# Altium project CameraSBC.PrjPcb
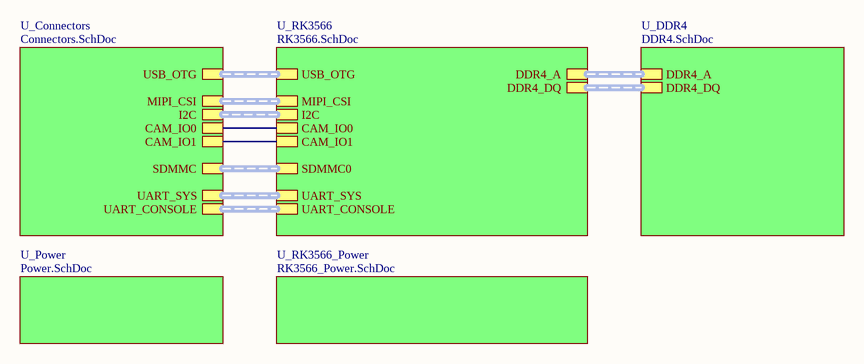
[diagram p0: Overview.SchDoc]
6 sheets, 95 parts. Net scope: hierarchical (ports join the sheet entries above them; power ports are global).
Board file: Layout.PcbDoc
Sheets:
  Overview.SchDoc
    U_RK3566_Power = RK3566_Power.SchDoc
    U_RK3566 = RK3566.SchDoc
    U_Connectors = Connectors.SchDoc
    U_DDR4 = DDR4.SchDoc
    U_Power = Power.SchDoc

## Sheet Overview.SchDoc
size A4; SheetNumber: 1; SheetTotal: 6

### Sub-sheets
U_Connectors = Connectors.SchDoc: USB_OTG (harness USB_OTG), MIPI_CSI (harness MIPI_CSI), I2C (harness I2C), CAM_IO0, CAM_IO1, SDMMC (harness SDMMC), UART_SYS (harness UART), UART_CONSOLE (harness UART)
U_DDR4 = DDR4.SchDoc: DDR4_A (harness DDR4_A), DDR4_DQ (harness DDR4_DQ)
U_Power = Power.SchDoc: no entries
U_RK3566 = RK3566.SchDoc: MIPI_CSI (harness MIPI_CSI), SDMMC0 (harness SDMMC0), I2C (harness I2C), USB_OTG (harness USB_OTG), DDR4_DQ (harness DDR4_DQ), DDR4_A (harness DDR4_ACC), UART_SYS (harness UART_SYS), UART_CONSOLE (harness UART_CONSOLE), CAM_IO0, CAM_IO1
U_RK3566_Power = RK3566_Power.SchDoc: no entries

### Nets
CAM_IO0: sheet U_RK3566/CAM_IO0, sheet U_Connectors/CAM_IO0
CAM_IO1: sheet U_RK3566/CAM_IO1, sheet U_Connectors/CAM_IO1

### Buses and harness runs
harness sheet U_Connectors/I2C = sheet U_RK3566/I2C
harness sheet U_Connectors/MIPI_CSI = sheet U_RK3566/MIPI_CSI
harness sheet U_Connectors/SDMMC = sheet U_RK3566/SDMMC0
harness sheet U_Connectors/UART_CONSOLE = sheet U_RK3566/UART_CONSOLE
harness sheet U_Connectors/UART_SYS = sheet U_RK3566/UART_SYS
harness sheet U_Connectors/USB_OTG = sheet U_RK3566/USB_OTG
harness sheet U_DDR4/DDR4_A = sheet U_RK3566/DDR4_A
harness sheet U_DDR4/DDR4_DQ = sheet U_RK3566/DDR4_DQ

## Sheet RK3566_Power.SchDoc
size A2; SheetNumber: 3; SheetTotal: 6
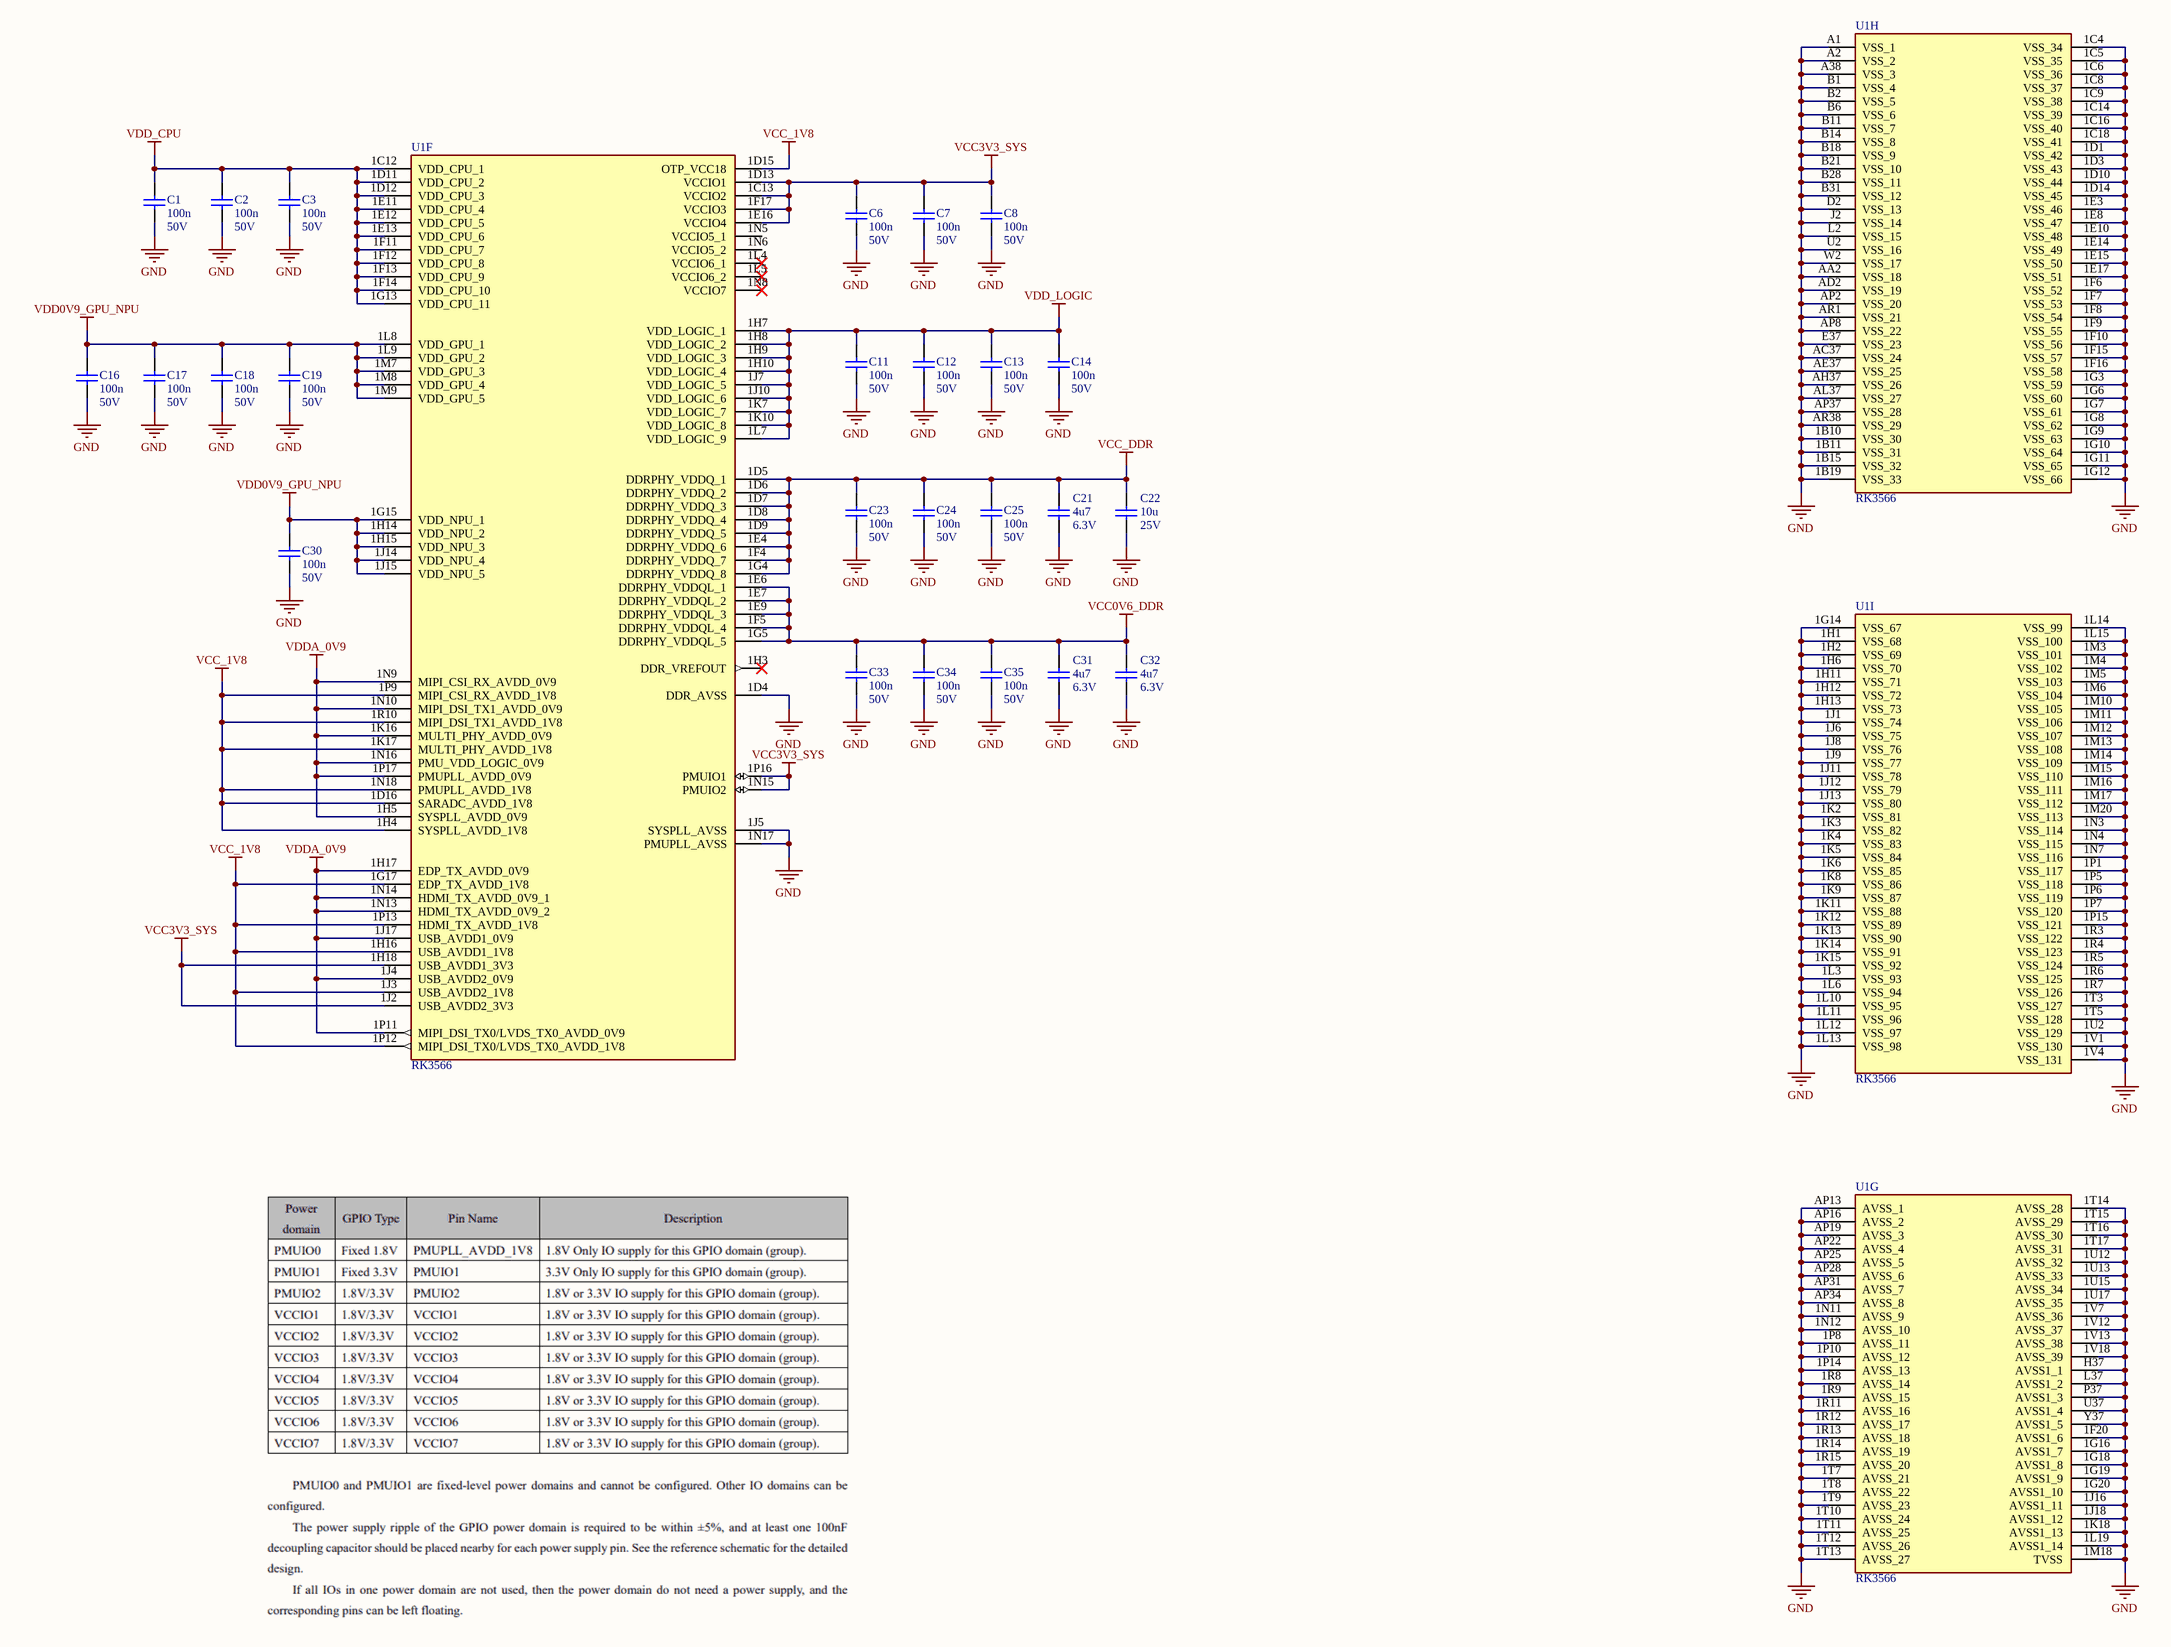
[diagram p1: RK3566_Power.SchDoc]

### Parts
C1  value 100n  Voltage: 50V  [GRM155R71H104KE14D]  (hidden comment: GRM155R71H104KE14D)
C2  value 100n  Voltage: 50V  [GRM155R71H104KE14D]  (hidden comment: GRM155R71H104KE14D)
C3  value 100n  Voltage: 50V  [GRM155R71H104KE14D]  (hidden comment: GRM155R71H104KE14D)
C6  value 100n  Voltage: 50V  [GRM155R71H104KE14D]  (hidden comment: GRM155R71H104KE14D)
C7  value 100n  Voltage: 50V  [GRM155R71H104KE14D]  (hidden comment: GRM155R71H104KE14D)
C8  value 100n  Voltage: 50V  [GRM155R71H104KE14D]  (hidden comment: GRM155R71H104KE14D)
C11  value 100n  Voltage: 50V  [GRM155R71H104KE14D]  (hidden comment: GRM155R71H104KE14D)
C12  value 100n  Voltage: 50V  [GRM155R71H104KE14D]  (hidden comment: GRM155R71H104KE14D)
C13  value 100n  Voltage: 50V  [GRM155R71H104KE14D]  (hidden comment: GRM155R71H104KE14D)
C14  value 100n  Voltage: 50V  [GRM155R71H104KE14D]  (hidden comment: GRM155R71H104KE14D)
C16  value 100n  Voltage: 50V  [GRM155R71H104KE14D]  (hidden comment: GRM155R71H104KE14D)
C17  value 100n  Voltage: 50V  [GRM155R71H104KE14D]  (hidden comment: GRM155R71H104KE14D)
C18  value 100n  Voltage: 50V  [GRM155R71H104KE14D]  (hidden comment: GRM155R71H104KE14D)
C19  value 100n  Voltage: 50V  [GRM155R71H104KE14D]  (hidden comment: GRM155R71H104KE14D)
C21  value 4u7  Voltage: 6.3V  [GRM155R60J475ME47D]  (hidden comment: GRM155R60J475ME47D)
C22  value 10u  Voltage: 25V  (hidden comment: GRM188R61E106MA73D)
C23  value 100n  Voltage: 50V  [GRM155R71H104KE14D]  (hidden comment: GRM155R71H104KE14D)
C24  value 100n  Voltage: 50V  [GRM155R71H104KE14D]  (hidden comment: GRM155R71H104KE14D)
C25  value 100n  Voltage: 50V  [GRM155R71H104KE14D]  (hidden comment: GRM155R71H104KE14D)
C30  value 100n  Voltage: 50V  [GRM155R71H104KE14D]  (hidden comment: GRM155R71H104KE14D)
C31  value 4u7  Voltage: 6.3V  [GRM155R60J475ME47D]  (hidden comment: GRM155R60J475ME47D)
C32  value 4u7  Voltage: 6.3V  [GRM155R60J475ME47D]  (hidden comment: GRM155R60J475ME47D)
C33  value 100n  Voltage: 50V  [GRM155R71H104KE14D]  (hidden comment: GRM155R71H104KE14D)
C34  value 100n  Voltage: 50V  [GRM155R71H104KE14D]  (hidden comment: GRM155R71H104KE14D)
C35  value 100n  Voltage: 50V  [GRM155R71H104KE14D]  (hidden comment: GRM155R71H104KE14D)
U1  RK3566  [RK3566]  (parts F,G,H,I of 9)

### Nets
GND: C1.2 C2.2 C3.2 C6.2 C7.2 C8.2 C11.2 C12.2 C13.2 C14.2 C16.2 C17.2 C18.2 C19.2 C21.2 C22.2 C23.2 C24.2 C25.2 C30.2 C31.2 C32.2 C33.2 C34.2 C35.2 U1.1B10(VSS_30) U1.1B11(VSS_31) U1.1B15(VSS_32) U1.1B19(VSS_33) U1.1C4(VSS_34) U1.1C5(VSS_35) U1.1C6(VSS_36) U1.1C8(VSS_37) U1.1C9(VSS_38) U1.1C14(VSS_39) U1.1C16(VSS_40) U1.1C18(VSS_41) U1.1D1(VSS_42) U1.1D3(VSS_43) U1.1D4(DDR_AVSS) U1.1D10(VSS_44) U1.1D14(VSS_45) U1.1E3(VSS_46) U1.1E8(VSS_47) U1.1E10(VSS_48) U1.1E14(VSS_49) U1.1E15(VSS_50) U1.1E17(VSS_51) U1.1F6(VSS_52) U1.1F7(VSS_53) U1.1F8(VSS_54) U1.1F9(VSS_55) U1.1F10(VSS_56) U1.1F15(VSS_57) U1.1F16(VSS_58) U1.1F20(AVSS1_6) U1.1G3(VSS_59) U1.1G6(VSS_60) U1.1G7(VSS_61) U1.1G8(VSS_62) U1.1G9(VSS_63) U1.1G10(VSS_64) U1.1G11(VSS_65) U1.1G12(VSS_66) U1.1G14(VSS_67) U1.1G16(AVSS1_7) U1.1G18(AVSS1_8) U1.1G19(AVSS1_9) U1.1G20(AVSS1_10) U1.1H1(VSS_68) U1.1H2(VSS_69) U1.1H6(VSS_70) U1.1H11(VSS_71) U1.1H12(VSS_72) U1.1H13(VSS_73) U1.1J1(VSS_74) U1.1J5(SYSPLL_AVSS) U1.1J6(VSS_75) U1.1J8(VSS_76) U1.1J9(VSS_77) U1.1J11(VSS_78) U1.1J12(VSS_79) U1.1J13(VSS_80) U1.1J16(AVSS1_11) U1.1J18(AVSS1_12) U1.1K2(VSS_81) U1.1K3(VSS_82) U1.1K4(VSS_83) U1.1K5(VSS_84) U1.1K6(VSS_85) U1.1K8(VSS_86) U1.1K9(VSS_87) U1.1K11(VSS_88) U1.1K12(VSS_89) U1.1K13(VSS_90) U1.1K14(VSS_91) U1.1K15(VSS_92) U1.1K18(AVSS1_13) U1.1L3(VSS_93) U1.1L6(VSS_94) U1.1L10(VSS_95) U1.1L11(VSS_96) U1.1L12(VSS_97) U1.1L13(VSS_98) U1.1L14(VSS_99) U1.1L15(VSS_100) U1.1L19(AVSS1_14) U1.1M3(VSS_101) U1.1M4(VSS_102) U1.1M5(VSS_103) U1.1M6(VSS_104) U1.1M10(VSS_105) U1.1M11(VSS_106) U1.1M12(VSS_107) U1.1M13(VSS_108) U1.1M14(VSS_109) U1.1M15(VSS_110) U1.1M16(VSS_111) U1.1M17(VSS_112) U1.1M18(TVSS) U1.1M20(VSS_113) U1.1N3(VSS_114) U1.1N4(VSS_115) U1.1N7(VSS_116) U1.1N11(AVSS_9) U1.1N12(AVSS_10) U1.1N17(PMUPLL_AVSS) U1.1P1(VSS_117) U1.1P5(VSS_118) U1.1P6(VSS_119) U1.1P7(VSS_120) U1.1P8(AVSS_11) U1.1P10(AVSS_12) U1.1P14(AVSS_13) U1.1P15(VSS_121) U1.1R3(VSS_122) U1.1R4(VSS_123) U1.1R5(VSS_124) U1.1R6(VSS_125) U1.1R7(VSS_126) U1.1R8(AVSS_14) U1.1R9(AVSS_15) U1.1R11(AVSS_16) U1.1R12(AVSS_17) U1.1R13(AVSS_18) U1.1R14(AVSS_19) U1.1R15(AVSS_20) U1.1T3(VSS_127) U1.1T5(VSS_128) U1.1T7(AVSS_21) U1.1T8(AVSS_22) U1.1T9(AVSS_23) U1.1T10(AVSS_24) U1.1T11(AVSS_25) U1.1T12(AVSS_26) U1.1T13(AVSS_27) U1.1T14(AVSS_28) U1.1T15(AVSS_29) U1.1T16(AVSS_30) U1.1T17(AVSS_31) U1.1U2(VSS_129) U1.1U12(AVSS_32) U1.1U13(AVSS_33) U1.1U15(AVSS_34) U1.1U17(AVSS_35) U1.1V1(VSS_130) U1.1V4(VSS_131) U1.1V7(AVSS_36) U1.1V12(AVSS_37) U1.1V13(AVSS_38) U1.1V18(AVSS_39) U1.A1(VSS_1) U1.A2(VSS_2) U1.A38(VSS_3) U1.AA2(VSS_18) U1.AC37(VSS_24) U1.AD2(VSS_19) U1.AE37(VSS_25) U1.AH37(VSS_26) U1.AL37(VSS_27) U1.AP2(VSS_20) U1.AP8(VSS_22) U1.AP13(AVSS_1) U1.AP16(AVSS_2) U1.AP19(AVSS_3) U1.AP22(AVSS_4) U1.AP25(AVSS_5) U1.AP28(AVSS_6) U1.AP31(AVSS_7) U1.AP34(AVSS_8) U1.AP37(VSS_28) U1.AR1(VSS_21) U1.AR38(VSS_29) U1.B1(VSS_4) U1.B2(VSS_5) U1.B6(VSS_6) U1.B11(VSS_7) U1.B14(VSS_8) U1.B18(VSS_9) U1.B21(VSS_10) U1.B28(VSS_11) U1.B31(VSS_12) U1.D2(VSS_13) U1.E37(VSS_23) U1.H37(AVSS1_1) U1.J2(VSS_14) U1.L2(VSS_15) U1.L37(AVSS1_2) U1.P37(AVSS1_3) U1.U2(VSS_16) U1.U37(AVSS1_4) U1.W2(VSS_17) U1.Y37(AVSS1_5)
VCC0V6_DDR: C31.1 C32.1 C33.1 C34.1 C35.1 U1.1E6(DDRPHY_VDDQL_1) U1.1E7(DDRPHY_VDDQL_2) U1.1E9(DDRPHY_VDDQL_3) U1.1F5(DDRPHY_VDDQL_4) U1.1G5(DDRPHY_VDDQL_5)
VCC3V3_SYS: C6.1 C7.1 C8.1 U1.1C13(VCCIO2) U1.1D13(VCCIO1) U1.1E16(VCCIO4) U1.1F17(VCCIO3) U1.1H18(USB_AVDD1_3V3) U1.1J2(USB_AVDD2_3V3) U1.1N15(PMUIO2) U1.1P16(PMUIO1)
VCC_1V8: U1.1D15(OTP_VCC18) U1.1D16(SARADC_AVDD_1V8) U1.1G17(EDP_TX_AVDD_1V8) U1.1H4(SYSPLL_AVDD_1V8) U1.1H16(USB_AVDD1_1V8) U1.1J3(USB_AVDD2_1V8) U1.1K17(MULTI_PHY_AVDD_1V8) U1.1N18(PMUPLL_AVDD_1V8) U1.1P9(MIPI_CSI_RX_AVDD_1V8) U1.1P12(MIPI_DSI_TX0/LVDS_TX0_AVDD_1V8) U1.1P13(HDMI_TX_AVDD_1V8) U1.1R10(MIPI_DSI_TX1_AVDD_1V8)
VCC_DDR: C21.1 C22.1 C23.1 C24.1 C25.1 U1.1D5(DDRPHY_VDDQ_1) U1.1D6(DDRPHY_VDDQ_2) U1.1D7(DDRPHY_VDDQ_3) U1.1D8(DDRPHY_VDDQ_4) U1.1D9(DDRPHY_VDDQ_5) U1.1E4(DDRPHY_VDDQ_6) U1.1F4(DDRPHY_VDDQ_7) U1.1G4(DDRPHY_VDDQ_8)
VDD0V9_GPU_NPU: C16.1 C17.1 C18.1 C19.1 C30.1 U1.1G15(VDD_NPU_1) U1.1H14(VDD_NPU_2) U1.1H15(VDD_NPU_3) U1.1J14(VDD_NPU_4) U1.1J15(VDD_NPU_5) U1.1L8(VDD_GPU_1) U1.1L9(VDD_GPU_2) U1.1M7(VDD_GPU_3) U1.1M8(VDD_GPU_4) U1.1M9(VDD_GPU_5)
VDD_CPU: C1.1 C2.1 C3.1 U1.1C12(VDD_CPU_1) U1.1D11(VDD_CPU_2) U1.1D12(VDD_CPU_3) U1.1E11(VDD_CPU_4) U1.1E12(VDD_CPU_5) U1.1E13(VDD_CPU_6) U1.1F11(VDD_CPU_7) U1.1F12(VDD_CPU_8) U1.1F13(VDD_CPU_9) U1.1F14(VDD_CPU_10) U1.1G13(VDD_CPU_11)
VDD_LOGIC: C11.1 C12.1 C13.1 C14.1 U1.1H7(VDD_LOGIC_1) U1.1H8(VDD_LOGIC_2) U1.1H9(VDD_LOGIC_3) U1.1H10(VDD_LOGIC_4) U1.1J7(VDD_LOGIC_5) U1.1J10(VDD_LOGIC_6) U1.1K7(VDD_LOGIC_7) U1.1K10(VDD_LOGIC_8) U1.1L7(VDD_LOGIC_9)
VDDA_0V9: U1.1H5(SYSPLL_AVDD_0V9) U1.1H17(EDP_TX_AVDD_0V9) U1.1J4(USB_AVDD2_0V9) U1.1J17(USB_AVDD1_0V9) U1.1K16(MULTI_PHY_AVDD_0V9) U1.1N9(MIPI_CSI_RX_AVDD_0V9) U1.1N10(MIPI_DSI_TX1_AVDD_0V9) U1.1N13(HDMI_TX_AVDD_0V9_2) U1.1N14(HDMI_TX_AVDD_0V9_1) U1.1N16(PMU_VDD_LOGIC_0V9) U1.1P11(MIPI_DSI_TX0/LVDS_TX0_AVDD_0V9) U1.1P17(PMUPLL_AVDD_0V9)

Not connected (* = marked no-connect by the designer): U1 1H3(DDR_VREFOUT)* 1L4(VCCIO6_1)* 1L5(VCCIO6_2)* 1N5(VCCIO5_1) 1N6(VCCIO5_2) 1N8(VCCIO7)*

### Library data of the parts
C1-C3 C6-C8 C11-C14 C16-C19 C23-C25 C30 C33-C35 = GRM155R71H104KE14D: CAP 100N 50V X7R 0402; Size: 0402; Dielectric: X7R; Manufacturer Part Number 1: GRM155R71H104KE14D
C21 C31 C32 = GRM155R60J475ME47D: CAP 4.7U 6.3V X5R 0402; Size: 0402; Dielectric: X5R; Manufacturer Part Number 1: GRM155R60J475ME47D
C22 = GRM188R61E106MA73D: CAP 10U 25V X5R 0603; Size: 0603; Dielectric: X5R
U1 = RK3566: high-performance and low-power quad-core application processor; MF: Fuzhou Rockchip Electronics Co; SnapEDA_Link: https://www.snapeda.com/parts/RK3566/Fuzhou+Rockchip+Electronics+Co/view-part/?ref=snap; Package: None; Value: *; MP: RK3566; Check_prices: https://www.snapeda.com/parts/RK3566/Fuzhou+Rockchip+Electronics+Co/view-part/?ref=eda

## Sheet RK3566.SchDoc
size A1; SheetNumber: 2; SheetTotal: 6
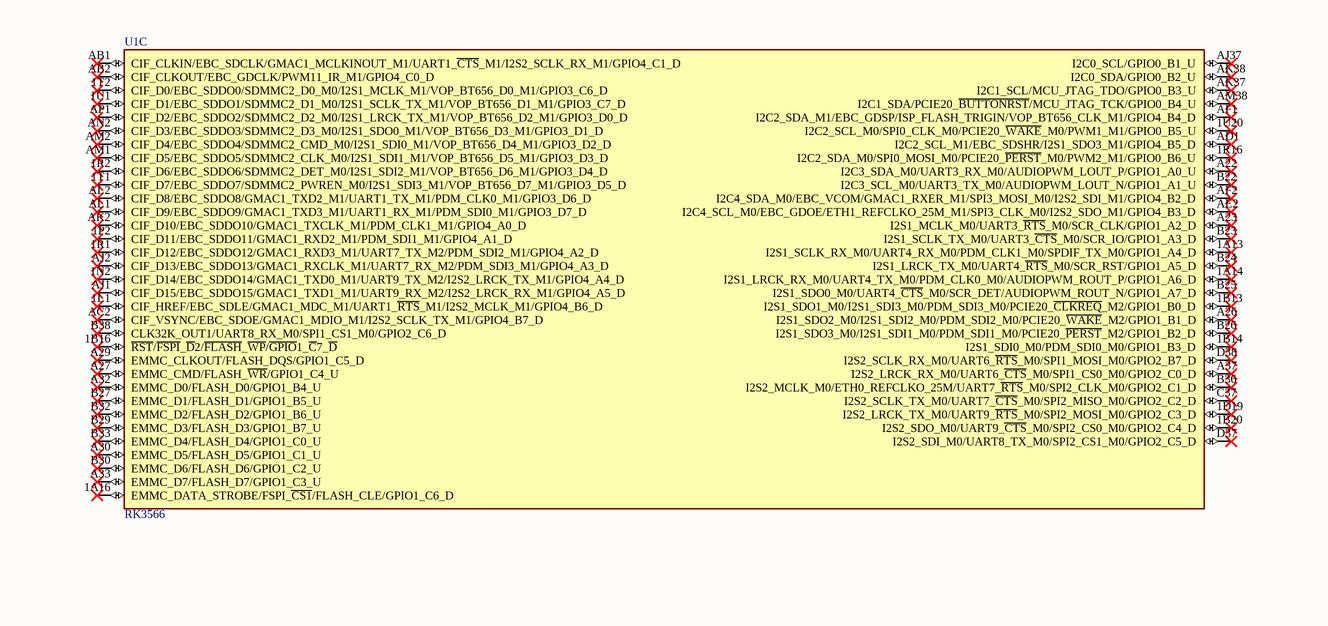
[diagram p2: RK3566.SchDoc, top left]
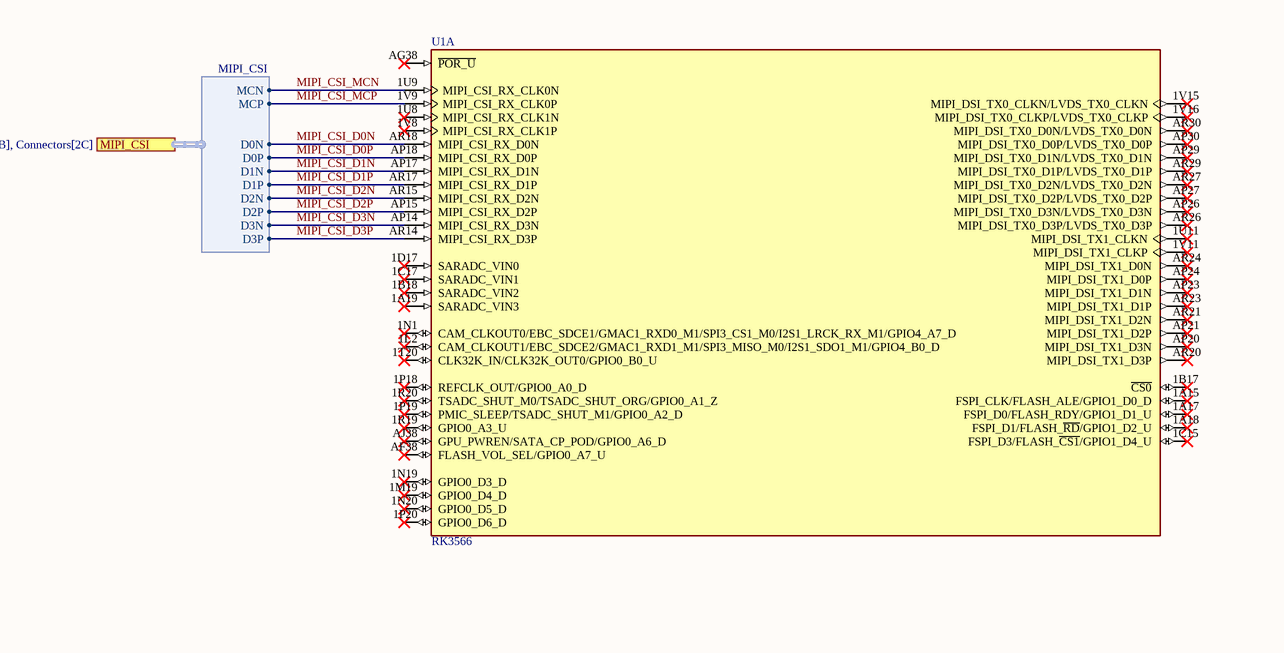
[diagram p3: RK3566.SchDoc, top right]
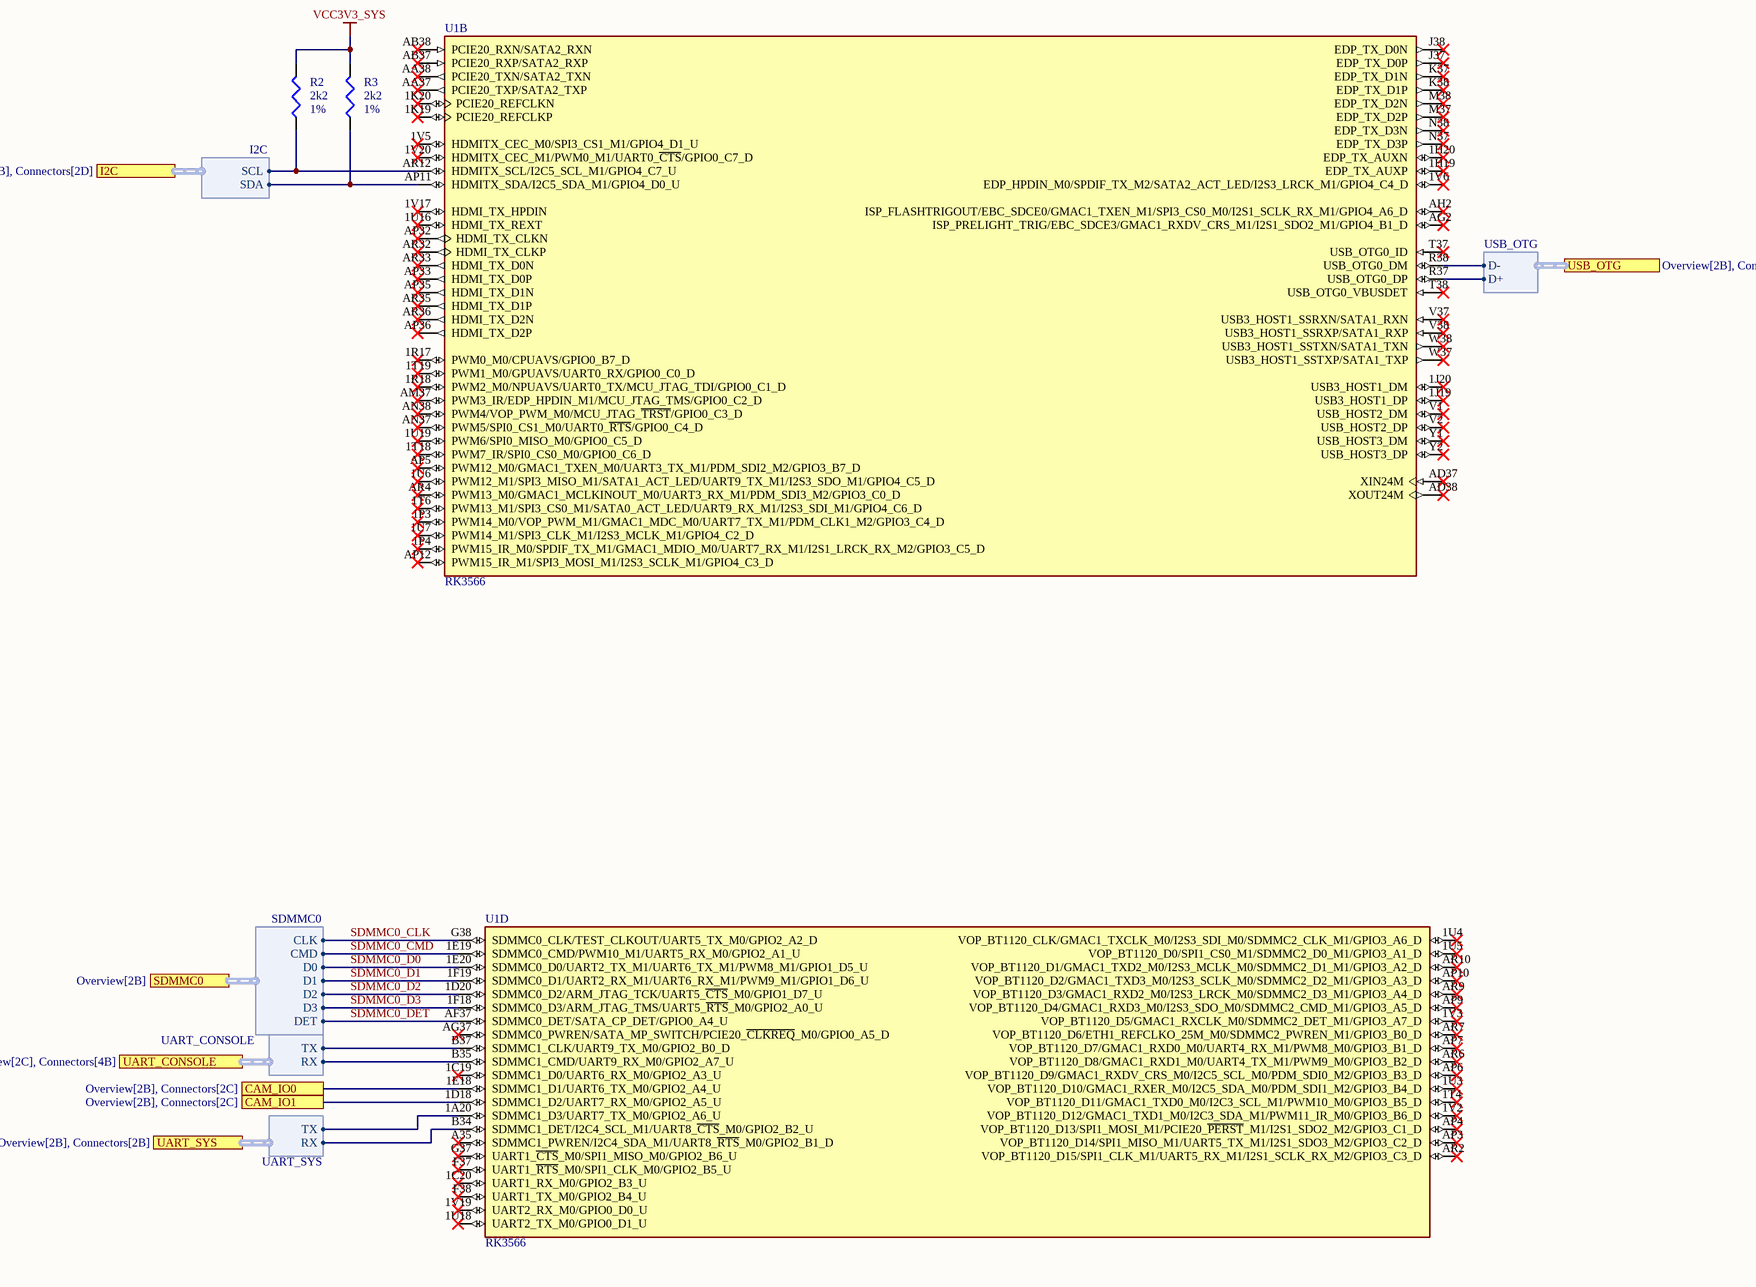
[diagram p4: RK3566.SchDoc, bottom left]
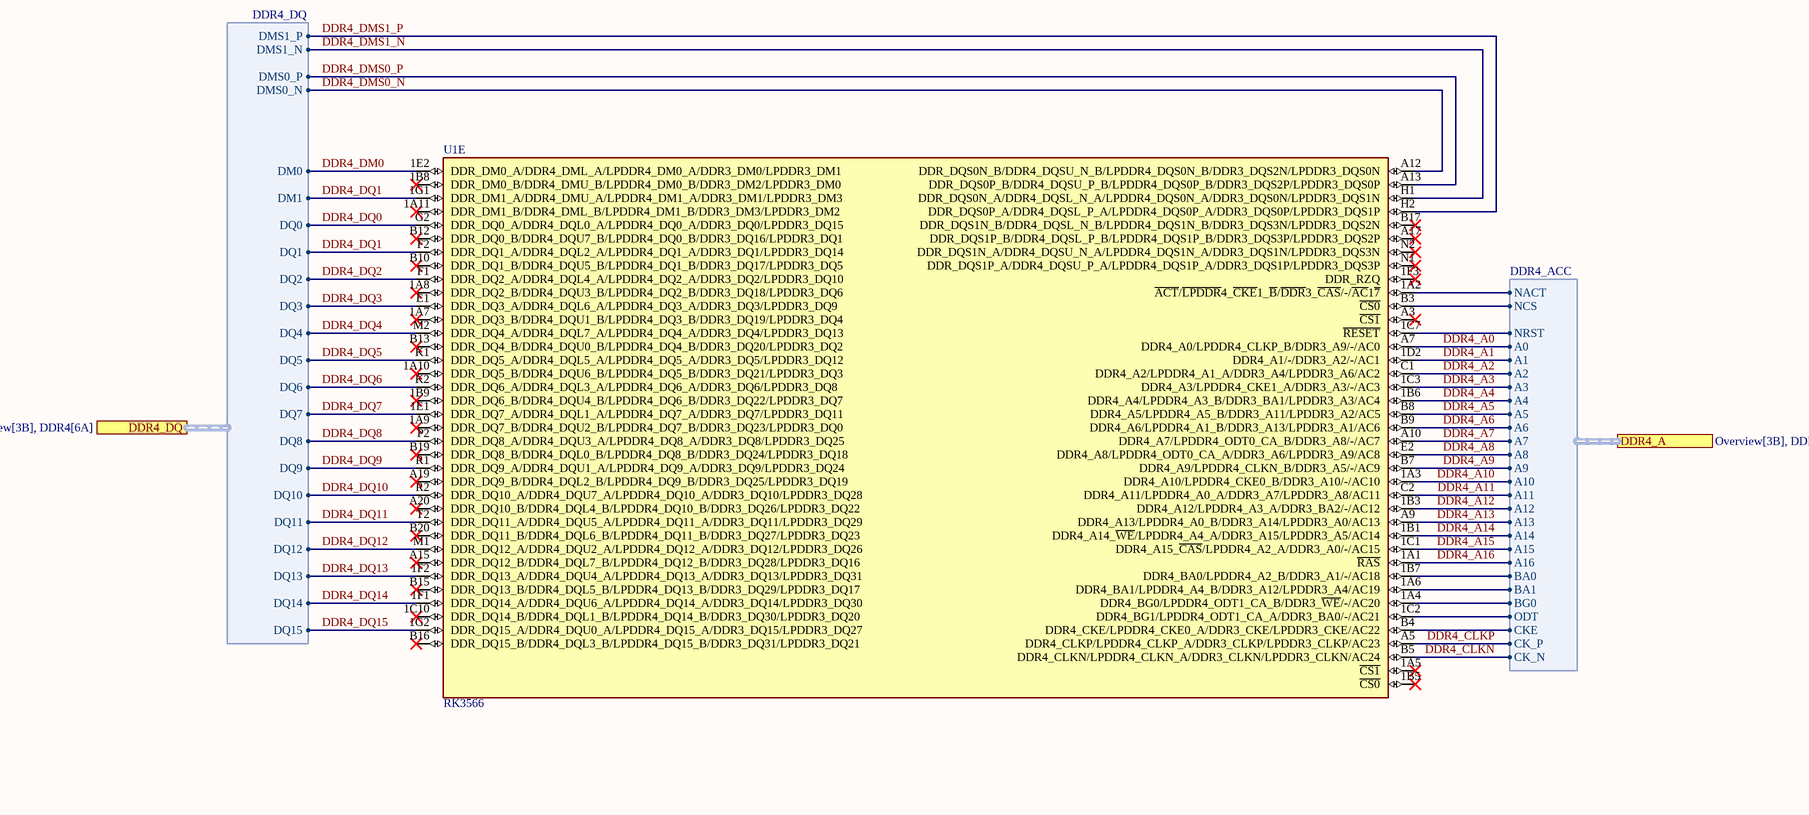
[diagram p5: RK3566.SchDoc, bottom right]

### Parts
R2  value 2k2  Tolerance: 1%  [RC0402FR-075K6L]  (hidden comment: RES 2.2K)
R3  value 2k2  Tolerance: 1%  [RC0402FR-075K6L]  (hidden comment: RES 2.2K)
U1  RK3566  [RK3566]  (parts A,B,C,D,E of 9)

### Ports
CAM_IO0 (see Overview[2B], Connectors[2C]), CAM_IO1 (see Overview[2B], Connectors[2C]), DDR4_A (harness DDR4_ACC, see Overview[3B], DDR4[2B]), DDR4_DQ (harness DDR4_DQ, see Overview[3B], DDR4[6A]), I2C (harness I2C, see Overview[2B], Connectors[2D]), MIPI_CSI (harness MIPI_CSI, see Overview[2B], Connectors[2C]), SDMMC0 (harness SDMMC0, see Overview[2B]), UART_CONSOLE (harness UART_CONSOLE, see Overview[2C], Connectors[4B]), UART_SYS (harness UART_SYS, see Overview[2B], Connectors[2B]), USB_OTG (harness USB_OTG, see Overview[2B], Connectors[6B])

### Harnesses
MIPI_CSI: D0N, D0P, MCN, MCP, D1P, D1N, D2P, D2N, D3N, D3P
SDMMC0: CLK, CMD, D0, D1, D3, D2, DET
I2C: SCL, SDA
USB_OTG: D-, D+
DDR4_ACC: A0, A1, A2, A3, A4, A5, A6, A7, A8, A10, A9, A11, A13, A12, A14, A15, A16, NCS, NACT, BG0, BA0, BA1, CKE, CK_P, CK_N, ODT, NRST
DDR4_DQ: DQ0, DQ1, DQ2, DQ3, DQ4, DQ5, DQ6, DQ7, DQ8, DQ10, DQ9, DQ11, DQ13, DQ12, DQ14, DQ15, DMS0_P, DMS0_N, DMS1_N, DMS1_P, DM0, DM1
UART_SYS: TX, RX
UART_CONSOLE: TX, RX

### Nets
VCC3V3_SYS: R2.1 R3.1
CAM_IO0: U1.1E18(SDMMC1_D1/UART6_TX_M0/GPIO2_A4_U) ; port CAM_IO0
CAM_IO1: U1.1D18(SDMMC1_D2/UART7_RX_M0/GPIO2_A5_U) ; port CAM_IO1
CAM_SCL: R2.2 U1.AR12(HDMITX_SCL/I2C5_SCL_M1/GPIO4_C7_U) ; port I2C.SCL
CAM_SDA: R3.2 U1.AP11(HDMITX_SDA/I2C5_SDA_M1/GPIO4_D0_U) ; port I2C.SDA
DDR4_A0: U1.A7(DDR4_A0/LPDDR4_CLKP_B/DDR3_A9/-/AC0) ; port DDR4_A.A0
DDR4_A1: U1.1D2(DDR4_A1/-/DDR3_A2/-/AC1) ; port DDR4_A.A1
DDR4_A2: U1.C1(DDR4_A2/LPDDR4_A1_A/DDR3_A4/LPDDR3_A6/AC2) ; port DDR4_A.A2
DDR4_A3: U1.1C3(DDR4_A3/LPDDR4_CKE1_A/DDR3_A3/-/AC3) ; port DDR4_A.A3
DDR4_A4: U1.1B6(DDR4_A4/LPDDR4_A3_B/DDR3_BA1/LPDDR3_A3/AC4) ; port DDR4_A.A4
DDR4_A5: U1.B8(DDR4_A5/LPDDR4_A5_B/DDR3_A11/LPDDR3_A2/AC5) ; port DDR4_A.A5
DDR4_A6: U1.B9(DDR4_A6/LPDDR4_A1_B/DDR3_A13/LPDDR3_A1/AC6) ; port DDR4_A.A6
DDR4_A7: U1.A10(DDR4_A7/LPDDR4_ODT0_CA_B/DDR3_A8/-/AC7) ; port DDR4_A.A7
DDR4_A8: U1.E2(DDR4_A8/LPDDR4_ODT0_CA_A/DDR3_A6/LPDDR3_A9/AC8) ; port DDR4_A.A8
DDR4_A9: U1.B7(DDR4_A9/LPDDR4_CLKN_B/DDR3_A5/-/AC9) ; port DDR4_A.A9
DDR4_A10: U1.1A3(DDR4_A10/LPDDR4_CKE0_B/DDR3_A10/-/AC10) ; port DDR4_A.A10
DDR4_A11: U1.C2(DDR4_A11/LPDDR4_A0_A/DDR3_A7/LPDDR3_A8/AC11) ; port DDR4_A.A11
DDR4_A12: U1.1B3(DDR4_A12/LPDDR4_A3_A/DDR3_BA2/-/AC12) ; port DDR4_A.A12
DDR4_A13: U1.A9(DDR4_A13/LPDDR4_A0_B/DDR3_A14/LPDDR3_A0/AC13) ; port DDR4_A.A13
DDR4_A14: U1.1B1(DDR4_A14_~{WE}/LPDDR4_A4_A/DDR3_A15/LPDDR3_A5/AC14) ; port DDR4_A.A14
DDR4_A15: U1.1C1(DDR4_A15_~{CAS}/LPDDR4_A2_A/DDR3_A0/-/AC15) ; port DDR4_A.A15
DDR4_A16: U1.1A1(~{RAS}) ; port DDR4_A.A16
DDR4_BA0: U1.1B7(DDR4_BA0/LPDDR4_A2_B/DDR3_A1/-/AC18) ; port DDR4_A.BA0
DDR4_BA1: U1.1A6(DDR4_BA1/LPDDR4_A4_B/DDR3_A12/LPDDR3_A4/AC19) ; port DDR4_A.BA1
DDR4_BG0: U1.1A4(DDR4_BG0/LPDDR4_ODT1_CA_B/DDR3_~{WE}/-/AC20) ; port DDR4_A.BG0
DDR4_CKE: U1.B4(DDR4_CKE/LPDDR4_CKE0_A/DDR3_CKE/LPDDR3_CKE/AC22) ; port DDR4_A.CKE
DDR4_CLKN: U1.B5(DDR4_CLKN/LPDDR4_CLKN_A/DDR3_CLKN/LPDDR3_CLKN/AC24) ; port DDR4_A.CK_N  [project net DDR4_CK_N]
DDR4_CLKP: U1.A5(DDR4_CLKP/LPDDR4_CLKP_A/DDR3_CLKP/LPDDR3_CLKP/AC23) ; port DDR4_A.CK_P  [project net DDR4_CK_P]
DDR4_DM0: U1.1E2(DDR_DM0_A/DDR4_DML_A/LPDDR4_DM0_A/DDR3_DM0/LPDDR3_DM1) ; port DDR4_DQ.DM0
DDR4_DMS0_N: U1.A12(DDR_DQS0N_B/DDR4_DQSU_N_B/LPDDR4_DQS0N_B/DDR3_DQS2N/LPDDR3_DQS0N) ; port DDR4_DQ.DMS0_N
DDR4_DMS0_P: U1.A13(DDR_DQS0P_B/DDR4_DQSU_P_B/LPDDR4_DQS0P_B/DDR3_DQS2P/LPDDR3_DQS0P) ; port DDR4_DQ.DMS0_P
DDR4_DMS1_N: U1.H1(DDR_DQS0N_A/DDR4_DQSL_N_A/LPDDR4_DQS0N_A/DDR3_DQS0N/LPDDR3_DQS1N) ; port DDR4_DQ.DMS1_N
DDR4_DMS1_P: U1.H2(DDR_DQS0P_A/DDR4_DQSL_P_A/LPDDR4_DQS0P_A/DDR3_DQS0P/LPDDR3_DQS1P) ; port DDR4_DQ.DMS1_P
DDR4_DQ0: U1.G2(DDR_DQ0_A/DDR4_DQL0_A/LPDDR4_DQ0_A/DDR3_DQ0/LPDDR3_DQ15) ; port DDR4_DQ.DQ0
DDR4_DQ1: U1.1G1(DDR_DM1_A/DDR4_DMU_A/LPDDR4_DM1_A/DDR3_DM1/LPDDR3_DM3) U1.F2(DDR_DQ1_A/DDR4_DQL2_A/LPDDR4_DQ1_A/DDR3_DQ1/LPDDR3_DQ14) ; port DDR4_DQ.DQ1, port DDR4_DQ.DM1  [project net DDR4_DM1]
DDR4_DQ2: U1.F1(DDR_DQ2_A/DDR4_DQL4_A/LPDDR4_DQ2_A/DDR3_DQ2/LPDDR3_DQ10) ; port DDR4_DQ.DQ2
DDR4_DQ3: U1.E1(DDR_DQ3_A/DDR4_DQL6_A/LPDDR4_DQ3_A/DDR3_DQ3/LPDDR3_DQ9) ; port DDR4_DQ.DQ3
DDR4_DQ4: U1.M2(DDR_DQ4_A/DDR4_DQL7_A/LPDDR4_DQ4_A/DDR3_DQ4/LPDDR3_DQ13) ; port DDR4_DQ.DQ4
DDR4_DQ5: U1.K1(DDR_DQ5_A/DDR4_DQL5_A/LPDDR4_DQ5_A/DDR3_DQ5/LPDDR3_DQ12) ; port DDR4_DQ.DQ5
DDR4_DQ6: U1.K2(DDR_DQ6_A/DDR4_DQL3_A/LPDDR4_DQ6_A/DDR3_DQ6/LPDDR3_DQ8) ; port DDR4_DQ.DQ6
DDR4_DQ7: U1.1E1(DDR_DQ7_A/DDR4_DQL1_A/LPDDR4_DQ7_A/DDR3_DQ7/LPDDR3_DQ11) ; port DDR4_DQ.DQ7
DDR4_DQ8: U1.P2(DDR_DQ8_A/DDR4_DQU3_A/LPDDR4_DQ8_A/DDR3_DQ8/LPDDR3_DQ25) ; port DDR4_DQ.DQ8
DDR4_DQ9: U1.R1(DDR_DQ9_A/DDR4_DQU1_A/LPDDR4_DQ9_A/DDR3_DQ9/LPDDR3_DQ24) ; port DDR4_DQ.DQ9
DDR4_DQ10: U1.R2(DDR_DQ10_A/DDR4_DQU7_A/LPDDR4_DQ10_A/DDR3_DQ10/LPDDR3_DQ28) ; port DDR4_DQ.DQ10
DDR4_DQ11: U1.T2(DDR_DQ11_A/DDR4_DQU5_A/LPDDR4_DQ11_A/DDR3_DQ11/LPDDR3_DQ29) ; port DDR4_DQ.DQ11
DDR4_DQ12: U1.M1(DDR_DQ12_A/DDR4_DQU2_A/LPDDR4_DQ12_A/DDR3_DQ12/LPDDR3_DQ26) ; port DDR4_DQ.DQ12
DDR4_DQ13: U1.1F2(DDR_DQ13_A/DDR4_DQU4_A/LPDDR4_DQ13_A/DDR3_DQ13/LPDDR3_DQ31) ; port DDR4_DQ.DQ13
DDR4_DQ14: U1.1F1(DDR_DQ14_A/DDR4_DQU6_A/LPDDR4_DQ14_A/DDR3_DQ14/LPDDR3_DQ30) ; port DDR4_DQ.DQ14
DDR4_DQ15: U1.1G2(DDR_DQ15_A/DDR4_DQU0_A/LPDDR4_DQ15_A/DDR3_DQ15/LPDDR3_DQ27) ; port DDR4_DQ.DQ15
DDR4_NACT: U1.1A2(~{ACT}/~{LPDDR}4_~{CKE}1_~{B}/~{DDR}3_~{CAS}/-/~{AC}1~{7}) ; port DDR4_A.NACT
DDR4_NCS: U1.B3(~{CS0}) ; port DDR4_A.NCS
DDR4_NRST: U1.1C7(~{RESET}) ; port DDR4_A.NRST
DDR4_ODT: U1.1C2(DDR4_BG1/LPDDR4_ODT1_CA_A/DDR3_BA0/-/AC21) ; port DDR4_A.ODT
MIPI_CSI_D0N: U1.AR18(MIPI_CSI_RX_D0N) ; port MIPI_CSI.D0N
MIPI_CSI_D0P: U1.AP18(MIPI_CSI_RX_D0P) ; port MIPI_CSI.D0P
MIPI_CSI_D1N: U1.AP17(MIPI_CSI_RX_D1N) ; port MIPI_CSI.D1N
MIPI_CSI_D1P: U1.AR17(MIPI_CSI_RX_D1P) ; port MIPI_CSI.D1P
MIPI_CSI_D2N: U1.AR15(MIPI_CSI_RX_D2N) ; port MIPI_CSI.D2N
MIPI_CSI_D2P: U1.AP15(MIPI_CSI_RX_D2P) ; port MIPI_CSI.D2P
MIPI_CSI_D3N: U1.AP14(MIPI_CSI_RX_D3N) ; port MIPI_CSI.D3N
MIPI_CSI_D3P: U1.AR14(MIPI_CSI_RX_D3P) ; port MIPI_CSI.D3P
MIPI_CSI_MCN: U1.1U9(MIPI_CSI_RX_CLK0N) ; port MIPI_CSI.MCN
MIPI_CSI_MCP: U1.1V9(MIPI_CSI_RX_CLK0P) ; port MIPI_CSI.MCP
SDMMC0_CLK: U1.G38(SDMMC0_CLK/TEST_CLKOUT/UART5_TX_M0/GPIO2_A2_D) ; port SDMMC0.CLK
SDMMC0_CMD: U1.1E19(SDMMC0_CMD/PWM10_M1/UART5_RX_M0/GPIO2_A1_U) ; port SDMMC0.CMD
SDMMC0_D0: U1.1E20(SDMMC0_D0/UART2_TX_M1/UART6_TX_M1/PWM8_M1/GPIO1_D5_U) ; port SDMMC0.D0
SDMMC0_D1: U1.1F19(SDMMC0_D1/UART2_RX_M1/UART6_RX_M1/PWM9_M1/GPIO1_D6_U) ; port SDMMC0.D1
SDMMC0_D2: U1.1D20(SDMMC0_D2/ARM_JTAG_TCK/UART5_~{CTS}_M0/GPIO1_D7_U) ; port SDMMC0.D2
SDMMC0_D3: U1.1F18(SDMMC0_D3/ARM_JTAG_TMS/UART5_~{RTS}_M0/GPIO2_A0_U) ; port SDMMC0.D3
SDMMC0_DET: U1.AF37(SDMMC0_DET/SATA_CP_DET/GPIO0_A4_U) ; port SDMMC0.DET
UART_CONSOLE_RX: U1.B35(SDMMC1_CMD/UART9_RX_M0/GPIO2_A7_U) ; port UART_CONSOLE.RX
UART_CONSOLE_TX: U1.B37(SDMMC1_CLK/UART9_TX_M0/GPIO2_B0_D) ; port UART_CONSOLE.TX
UART_SYS_RX: U1.B34(SDMMC1_DET/I2C4_SCL_M1/UART8_~{CTS}_M0/GPIO2_B2_U) ; port UART_SYS.RX
UART_SYS_TX: U1.1A20(SDMMC1_D3/UART7_TX_M0/GPIO2_A6_U) ; port UART_SYS.TX
USB_OTG_D+: U1.R37(USB_OTG0_DP) ; port USB_OTG.D+
USB_OTG_D-: U1.R38(USB_OTG0_DM) ; port USB_OTG.D-

Not connected (* = marked no-connect by the designer): U1 1A5(~{CS1})* 1A7(DDR_DQ3_B/DDR4_DQU1_B/LPDDR4_DQ3_B/DDR3_DQ19/LPDDR3_DQ4)* 1A8(DDR_DQ2_B/DDR4_DQU3_B/LPDDR4_DQ2_B/DDR3_DQ18/LPDDR3_DQ6)* 1A9(DDR_DQ7_B/DDR4_DQU2_B/LPDDR4_DQ7_B/DDR3_DQ23/LPDDR3_DQ0)* 1A10(DDR_DQ5_B/DDR4_DQU6_B/LPDDR4_DQ5_B/DDR3_DQ21/LPDDR3_DQ3)* 1A11(DDR_DM1_B/DDR4_DML_B/LPDDR4_DM1_B/DDR3_DM3/LPDDR3_DM2)* 1A13(I2S1_SCLK_RX_M0/UART4_RX_M0/PDM_CLK1_M0/SPDIF_TX_M0/GPIO1_A4_D)* 1A14(I2S1_LRCK_RX_M0/UART4_TX_M0/PDM_CLK0_M0/AUDIOPWM_ROUT_P/GPIO1_A6_D)* 1A15(FSPI_CLK/FLASH_ALE/GPIO1_D0_D)* 1A16(EMMC_DATA_STROBE/FSPI_~{CS1}/FLASH_CLE/GPIO1_C6_D)* 1A17(FSPI_D0/FLASH_RDY/GPIO1_D1_U)* 1A18(FSPI_D1/FLASH_~{RD}/GPIO1_D2_U)* 1A19(SARADC_VIN3)* 1B5(~{CS0})* 1B8(DDR_DM0_B/DDR4_DMU_B/LPDDR4_DM0_B/DDR3_DM2/LPDDR3_DM0)* 1B9(DDR_DQ6_B/DDR4_DQU4_B/LPDDR4_DQ6_B/DDR3_DQ22/LPDDR3_DQ7)* 1B13(I2S1_SDO1_M0/I2S1_SDI3_M0/PDM_SDI3_M0/PCIE20_~{CLKREQ}_M2/GPIO1_B0_D)* 1B14(I2S1_SDI0_M0/PDM_SDI0_M0/GPIO1_B3_D)* 1B16(~{RST}/~{FSPI}_~{D}2/~{FLASH}_~{WP}/~{GPIO}1_~{C}7_~{D})* 1B17(~{CS0})* 1B18(SARADC_VIN2)* 1B20(I2S2_SDO_M0/UART9_~{CTS}_M0/SPI2_CS0_M0/GPIO2_C4_D)* 1C10(DDR_DQ14_B/DDR4_DQL1_B/LPDDR4_DQ14_B/DDR3_DQ30/LPDDR3_DQ20)* 1C15(FSPI_D3/FLASH_~{CS1}/GPIO1_D4_U)* 1C17(SARADC_VIN1)* 1C19(SDMMC1_D0/UART6_RX_M0/GPIO2_A3_U)* 1C20(UART1_RX_M0/GPIO2_B3_U)* 1D17(SARADC_VIN0)* 1D19(I2S2_LRCK_TX_M0/UART9_~{RTS}_M0/SPI2_MOSI_M0/GPIO2_C3_D)* 1F3(DDR_RZQ)* 1H19(EDP_TX_AUXP)* 1H20(EDP_TX_AUXN)* 1J19(USB3_HOST1_DP)* 1J20(USB3_HOST1_DM)* 1K19(PCIE20_REFCLKP)* 1K20(PCIE20_REFCLKN)* 1L1(CIF_HREF/EBC_SDLE/GMAC1_MDC_M1/UART1_~{RTS}_M1/I2S2_MCLK_M1/GPIO4_B6_D)* 1L2(CAM_CLKOUT1/EBC_SDCE2/GMAC1_RXD1_M1/SPI3_MISO_M0/I2S1_SDO1_M1/GPIO4_B0_D)* 1M19(GPIO0_D4_D)* 1N1(CAM_CLKOUT0/EBC_SDCE1/GMAC1_RXD0_M1/SPI3_CS1_M0/I2S1_LRCK_RX_M1/GPIO4_A7_D)* 1N2(CIF_D14/EBC_SDDO14/GMAC1_TXD0_M1/UART9_TX_M2/I2S2_LRCK_TX_M1/GPIO4_A4_D)* 1N19(GPIO0_D3_D)* 1N20(GPIO0_D5_D)* 1P2(CIF_D11/EBC_SDDO11/GMAC1_RXD2_M1/PDM_SDI1_M1/GPIO4_A1_D)* 1P3(PWM14_M0/VOP_PWM_M1/GMAC1_MDC_M0/UART7_TX_M1/PDM_CLK1_M2/GPIO3_C4_D)* 1P4(PWM15_IR_M0/SPDIF_TX_M1/GMAC1_MDIO_M0/UART7_RX_M1/I2S1_LRCK_RX_M2/GPIO3_C5_D)* 1P18(REFCLK_OUT/GPIO0_A0_D)* 1P19(PMIC_SLEEP/TSADC_SHUT_M1/GPIO0_A2_D)* 1P20(GPIO0_D6_D)* 1R1(CIF_D12/EBC_SDDO12/GMAC1_RXD3_M1/UART7_TX_M2/PDM_SDI2_M1/GPIO4_A2_D)* 1R2(CIF_D6/EBC_SDDO6/SDMMC2_DET_M0/I2S1_SDI2_M1/VOP_BT656_D6_M1/GPIO3_D4_D)* 1R16(I2C2_SDA_M0/SPI0_MOSI_M0/PCIE20_~{PERST}_M0/PWM2_M1/GPIO0_B6_U)* 1R17(PWM0_M0/CPUAVS/GPIO0_B7_D)* 1R18(PWM2_M0/NPUAVS/UART0_TX/MCU_JTAG_TDI/GPIO0_C1_D)* 1R19(GPIO0_A3_U)* 1R20(TSADC_SHUT_M0/TSADC_SHUT_ORG/GPIO0_A1_Z)* 1T1(CIF_D7/EBC_SDDO7/SDMMC2_PWREN_M0/I2S1_SDI3_M1/VOP_BT656_D7_M1/GPIO3_D5_D)* 1T2(CIF_D0/EBC_SDDO0/SDMMC2_D0_M0/I2S1_MCLK_M1/VOP_BT656_D0_M1/GPIO3_C6_D)* 1T4(VOP_BT1120_D11/GMAC1_TXD0_M0/I2C3_SCL_M1/PWM10_M0/GPIO3_B5_D)* 1T6(PWM13_M1/SPI3_CS0_M1/SATA0_ACT_LED/UART9_RX_M1/I2S3_SDI_M1/GPIO4_C6_D)* 1T18(PWM7_IR/SPI0_CS0_M0/GPIO0_C6_D)* 1T19(PWM1_M0/GPUAVS/UART0_RX/GPIO0_C0_D)* 1T20(CLK32K_IN/CLK32K_OUT0/GPIO0_B0_U)* 1U1(CIF_D1/EBC_SDDO1/SDMMC2_D1_M0/I2S1_SCLK_TX_M1/VOP_BT656_D1_M1/GPIO3_C7_D)* 1U3(VOP_BT1120_D10/GMAC1_RXER_M0/I2C5_SDA_M0/PDM_SDI1_M2/GPIO3_B4_D)* 1U4(VOP_BT1120_CLK/GMAC1_TXCLK_M0/I2S3_SDI_M0/SDMMC2_CLK_M1/GPIO3_A6_D)* 1U5(VOP_BT1120_D0/SPI1_CS0_M1/SDMMC2_D0_M1/GPIO3_A1_D)* 1U6(PWM12_M1/SPI3_MISO_M1/SATA1_ACT_LED/UART9_TX_M1/I2S3_SDO_M1/GPIO4_C5_D)* 1U7(PWM14_M1/SPI3_CLK_M1/I2S3_MCLK_M1/GPIO4_C2_D)* 1U8(MIPI_CSI_RX_CLK1N)* 1U11(MIPI_DSI_TX1_CLKN)* 1U16(HDMI_TX_REXT)* 1U18(UART2_TX_M0/GPIO0_D1_U)* 1U19(PWM6/SPI0_MISO_M0/GPIO0_C5_D)* 1U20(I2C2_SCL_M0/SPI0_CLK_M0/PCIE20_~{WAKE}_M0/PWM1_M1/GPIO0_B5_U)* 1V2(VOP_BT1120_D12/GMAC1_TXD1_M0/I2C3_SDA_M1/PWM11_IR_M0/GPIO3_B6_D)* 1V3(VOP_BT1120_D5/GMAC1_RXCLK_M0/SDMMC2_DET_M1/GPIO3_A7_D)* 1V5(HDMITX_CEC_M0/SPI3_CS1_M1/GPIO4_D1_U)* 1V6(EDP_HPDIN_M0/SPDIF_TX_M2/SATA2_ACT_LED/I2S3_LRCK_M1/GPIO4_C4_D)* 1V8(MIPI_CSI_RX_CLK1P)* 1V11(MIPI_DSI_TX1_CLKP)* 1V15(MIPI_DSI_TX0_CLKN/LVDS_TX0_CLKN)* 1V16(MIPI_DSI_TX0_CLKP/LVDS_TX0_CLKP)* 1V17(HDMI_TX_HPDIN)* 1V19(UART2_RX_M0/GPIO0_D0_U)* 1V20(HDMITX_CEC_M1/PWM0_M1/UART0_~{CTS}/GPIO0_C7_D)* A3(~{CS1})* A15(DDR_DQ12_B/DDR4_DQL7_B/LPDDR4_DQ12_B/DDR3_DQ28/LPDDR3_DQ16)* A17(DDR_DQS1P_B/DDR4_DQSL_P_B/LPDDR4_DQS1P_B/DDR3_DQS3P/LPDDR3_DQS2P)* A19(DDR_DQ9_B/DDR4_DQL2_B/LPDDR4_DQ9_B/DDR3_DQ25/LPDDR3_DQ19)* A20(DDR_DQ10_B/DDR4_DQL4_B/LPDDR4_DQ10_B/DDR3_DQ26/LPDDR3_DQ22)* A22(I2C3_SDA_M0/UART3_RX_M0/AUDIOPWM_LOUT_P/GPIO1_A0_U)* A23(I2S1_MCLK_M0/UART3_~{RTS}_M0/SCR_CLK/GPIO1_A2_D)* A26(I2S1_SDO2_M0/I2S1_SDI2_M0/PDM_SDI2_M0/PCIE20_~{WAKE}_M2/GPIO1_B1_D)* A27(EMMC_CMD/FLASH_~{WR}/GPIO1_C4_U)* A29(EMMC_CLKOUT/FLASH_DQS/GPIO1_C5_D)* A30(EMMC_D5/FLASH_D5/GPIO1_C1_U)* A32(EMMC_D0/FLASH_D0/GPIO1_B4_U)* A33(EMMC_D7/FLASH_D7/GPIO1_C3_U)* A35(SDMMC1_PWREN/I2C4_SDA_M1/UART8_~{RTS}_M0/GPIO2_B1_D)* A37(I2S2_LRCK_RX_M0/UART6_~{CTS}_M0/SPI1_CS0_M0/GPIO2_C0_D)* AA37(PCIE20_TXP/SATA2_TXP)* AA38(PCIE20_TXN/SATA2_TXN)* AB1(CIF_CLKIN/EBC_SDCLK/GMAC1_MCLKINOUT_M1/UART1_~{CTS}_M1/I2S2_SCLK_RX_M1/GPIO4_C1_D)* AB2(CIF_CLKOUT/EBC_GDCLK/PWM11_IR_M1/GPIO4_C0_D)* AB37(PCIE20_RXP/SATA2_RXP)* AB38(PCIE20_RXN/SATA2_RXN)* AC2(CIF_VSYNC/EBC_SDOE/GMAC1_MDIO_M1/I2S2_SCLK_TX_M1/GPIO4_B7_D)* AD1(I2C2_SCL_M1/EBC_SDSHR/I2S1_SDO3_M1/GPIO4_B5_D)* AD37(XIN24M)* AD38(XOUT24M)* AE2(I2C4_SCL_M0/EBC_GDOE/ETH1_REFCLKO_25M_M1/SPI3_CLK_M0/I2S2_SDO_M1/GPIO4_B3_D)* AF1(I2C2_SDA_M1/EBC_GDSP/ISP_FLASH_TRIGIN/VOP_BT656_CLK_M1/GPIO4_B4_D)* AF2(I2C4_SDA_M0/EBC_VCOM/GMAC1_RXER_M1/SPI3_MOSI_M0/I2S2_SDI_M1/GPIO4_B2_D)* AF38(FLASH_VOL_SEL/GPIO0_A7_U)* AG2(ISP_PRELIGHT_TRIG/EBC_SDCE3/GMAC1_RXDV_CRS_M1/I2S1_SDO2_M1/GPIO4_B1_D)* AG37(SDMMC0_PWREN/SATA_MP_SWITCH/PCIE20_~{CLKREQ}_M0/GPIO0_A5_D)* AG38(~{POR_U})* AH2(ISP_FLASHTRIGOUT/EBC_SDCE0/GMAC1_TXEN_M1/SPI3_CS0_M0/I2S1_SCLK_RX_M1/GPIO4_A6_D)* AJ1(CIF_D15/EBC_SDDO15/GMAC1_TXD1_M1/UART9_RX_M2/I2S2_LRCK_RX_M1/GPIO4_A5_D)* AJ2(CIF_D13/EBC_SDDO13/GMAC1_RXCLK_M1/UART7_RX_M2/PDM_SDI3_M1/GPIO4_A3_D)* AJ37(I2C0_SCL/GPIO0_B1_U)* AJ38(GPU_PWREN/SATA_CP_POD/GPIO0_A6_D)* AK2(CIF_D10/EBC_SDDO10/GMAC1_TXCLK_M1/PDM_CLK1_M1/GPIO4_A0_D)* AK37(I2C1_SCL/MCU_JTAG_TDO/GPIO0_B3_U)* AK38(I2C0_SDA/GPIO0_B2_U)* AL1(CIF_D9/EBC_SDDO9/GMAC1_TXD3_M1/UART1_RX_M1/PDM_SDI0_M1/GPIO3_D7_D)* AL2(CIF_D8/EBC_SDDO8/GMAC1_TXD2_M1/UART1_TX_M1/PDM_CLK0_M1/GPIO3_D6_D)* AM1(CIF_D5/EBC_SDDO5/SDMMC2_CLK_M0/I2S1_SDI1_M1/VOP_BT656_D5_M1/GPIO3_D3_D)* AM2(CIF_D4/EBC_SDDO4/SDMMC2_CMD_M0/I2S1_SDI0_M1/VOP_BT656_D4_M1/GPIO3_D2_D)* AM37(PWM3_IR/EDP_HPDIN_M1/MCU_JTAG_TMS/GPIO0_C2_D)* AM38(I2C1_SDA/PCIE20_~{BUTTONRST}/MCU_JTAG_TCK/GPIO0_B4_U)* AN2(CIF_D3/EBC_SDDO3/SDMMC2_D3_M0/I2S1_SDO0_M1/VOP_BT656_D3_M1/GPIO3_D1_D)* AN37(PWM5/SPI0_CS1_M0/UART0_~{RTS}/GPIO0_C4_D)* AN38(PWM4/VOP_PWM_M0/MCU_JTAG_~{TRST}/GPIO0_C3_D)* AP1(CIF_D2/EBC_SDDO2/SDMMC2_D2_M0/I2S1_LRCK_TX_M1/VOP_BT656_D2_M1/GPIO3_D0_D)* AP3(VOP_BT1120_D14/SPI1_MISO_M1/UART5_TX_M1/I2S1_SDO3_M2/GPIO3_C2_D)* AP4(VOP_BT1120_D13/SPI1_MOSI_M1/PCIE20_~{PERST}_M1/I2S1_SDO2_M2/GPIO3_C1_D)* AP5(PWM12_M0/GMAC1_TXEN_M0/UART3_TX_M1/PDM_SDI2_M2/GPIO3_B7_D)* AP6(VOP_BT1120_D9/GMAC1_RXDV_CRS_M0/I2C5_SCL_M0/PDM_SDI0_M2/GPIO3_B3_D)* AP7(VOP_BT1120_D7/GMAC1_RXD0_M0/UART4_RX_M1/PWM8_M0/GPIO3_B1_D)* AP9(VOP_BT1120_D4/GMAC1_RXD3_M0/I2S3_SDO_M0/SDMMC2_CMD_M1/GPIO3_A5_D)* AP10(VOP_BT1120_D2/GMAC1_TXD3_M0/I2S3_SCLK_M0/SDMMC2_D2_M1/GPIO3_A3_D)* AP12(PWM15_IR_M1/SPI3_MOSI_M1/I2S3_SCLK_M1/GPIO4_C3_D)* AP20(MIPI_DSI_TX1_D3N)* AP21(MIPI_DSI_TX1_D2P)* AP23(MIPI_DSI_TX1_D1N)* AP24(MIPI_DSI_TX1_D0P)* AP26(MIPI_DSI_TX0_D3N/LVDS_TX0_D3N)* AP27(MIPI_DSI_TX0_D2P/LVDS_TX0_D2P)* AP29(MIPI_DSI_TX0_D1N/LVDS_TX0_D1N)* AP30(MIPI_DSI_TX0_D0P/LVDS_TX0_D0P)* AP32(HDMI_TX_CLKN)* AP33(HDMI_TX_D0P)* AP35(HDMI_TX_D1N)* AP36(HDMI_TX_D2P)* AR2(VOP_BT1120_D15/SPI1_CLK_M1/UART5_RX_M1/I2S1_SCLK_RX_M2/GPIO3_C3_D)* AR4(PWM13_M0/GMAC1_MCLKINOUT_M0/UART3_RX_M1/PDM_SDI3_M2/GPIO3_C0_D)* AR6(VOP_BT1120_D8/GMAC1_RXD1_M0/UART4_TX_M1/PWM9_M0/GPIO3_B2_D)* AR7(VOP_BT1120_D6/ETH1_REFCLKO_25M_M0/SDMMC2_PWREN_M1/GPIO3_B0_D)* AR9(VOP_BT1120_D3/GMAC1_RXD2_M0/I2S3_LRCK_M0/SDMMC2_D3_M1/GPIO3_A4_D)* AR10(VOP_BT1120_D1/GMAC1_TXD2_M0/I2S3_MCLK_M0/SDMMC2_D1_M1/GPIO3_A2_D)* AR20(MIPI_DSI_TX1_D3P)* AR21(MIPI_DSI_TX1_D2N)* AR23(MIPI_DSI_TX1_D1P)* AR24(MIPI_DSI_TX1_D0N)* AR26(MIPI_DSI_TX0_D3P/LVDS_TX0_D3P)* AR27(MIPI_DSI_TX0_D2N/LVDS_TX0_D2N)* AR29(MIPI_DSI_TX0_D1P/LVDS_TX0_D1P)* AR30(MIPI_DSI_TX0_D0N/LVDS_TX0_D0N)* AR32(HDMI_TX_CLKP)* AR33(HDMI_TX_D0N)* AR35(HDMI_TX_D1P)* AR36(HDMI_TX_D2N)* B10(DDR_DQ1_B/DDR4_DQU5_B/LPDDR4_DQ1_B/DDR3_DQ17/LPDDR3_DQ5)* B12(DDR_DQ0_B/DDR4_DQU7_B/LPDDR4_DQ0_B/DDR3_DQ16/LPDDR3_DQ1)* B13(DDR_DQ4_B/DDR4_DQU0_B/LPDDR4_DQ4_B/DDR3_DQ20/LPDDR3_DQ2)* B15(DDR_DQ13_B/DDR4_DQL5_B/LPDDR4_DQ13_B/DDR3_DQ29/LPDDR3_DQ17)* B16(DDR_DQ15_B/DDR4_DQL3_B/LPDDR4_DQ15_B/DDR3_DQ31/LPDDR3_DQ21)* B17(DDR_DQS1N_B/DDR4_DQSL_N_B/LPDDR4_DQS1N_B/DDR3_DQS3N/LPDDR3_DQS2N)* B19(DDR_DQ8_B/DDR4_DQL0_B/LPDDR4_DQ8_B/DDR3_DQ24/LPDDR3_DQ18)* B20(DDR_DQ11_B/DDR4_DQL6_B/LPDDR4_DQ11_B/DDR3_DQ27/LPDDR3_DQ23)* B22(I2C3_SCL_M0/UART3_TX_M0/AUDIOPWM_LOUT_N/GPIO1_A1_U)* B23(I2S1_SCLK_TX_M0/UART3_~{CTS}_M0/SCR_IO/GPIO1_A3_D)* B24(I2S1_LRCK_TX_M0/UART4_~{RTS}_M0/SCR_RST/GPIO1_A5_D)* B25(I2S1_SDO0_M0/UART4_~{CTS}_M0/SCR_DET/AUDIOPWM_ROUT_N/GPIO1_A7_D)* B26(I2S1_SDO3_M0/I2S1_SDI1_M0/PDM_SDI1_M0/PCIE20_~{PERST}_M2/GPIO1_B2_D)* B27(EMMC_D1/FLASH_D1/GPIO1_B5_U)* B29(EMMC_D3/FLASH_D3/GPIO1_B7_U)* B30(EMMC_D6/FLASH_D6/GPIO1_C2_U)* B32(EMMC_D2/FLASH_D2/GPIO1_B6_U)* B33(EMMC_D4/FLASH_D4/GPIO1_C0_U)* B36(I2S2_MCLK_M0/ETH0_REFCLKO_25M/UART7_~{RTS}_M0/SPI2_CLK_M0/GPIO2_C1_D)* B38(CLK32K_OUT1/UART8_RX_M0/SPI1_CS1_M0/GPIO2_C6_D)* C37(I2S2_SCLK_TX_M0/UART7_~{CTS}_M0/SPI2_MISO_M0/GPIO2_C2_D)* D37(I2S2_SDI_M0/UART8_TX_M0/SPI2_CS1_M0/GPIO2_C5_D)* D38(I2S2_SCLK_RX_M0/UART6_~{RTS}_M0/SPI1_MOSI_M0/GPIO2_B7_D)* F37(UART1_~{RTS}_M0/SPI1_CLK_M0/GPIO2_B5_U)* F38(UART1_TX_M0/GPIO2_B4_U)* G37(UART1_~{CTS}_M0/SPI1_MISO_M0/GPIO2_B6_U)* J37(EDP_TX_D0P)* J38(EDP_TX_D0N)* K37(EDP_TX_D1N)* K38(EDP_TX_D1P)* M37(EDP_TX_D2P)* M38(EDP_TX_D2N)* N1(DDR_DQS1P_A/DDR4_DQSU_P_A/LPDDR4_DQS1P_A/DDR3_DQS1P/LPDDR3_DQS3P)* N2(DDR_DQS1N_A/DDR4_DQSU_N_A/LPDDR4_DQS1N_A/DDR3_DQS1N/LPDDR3_DQS3N)* N37(EDP_TX_D3P)* N38(EDP_TX_D3N)* T37(USB_OTG0_ID)* T38(USB_OTG0_VBUSDET)* V1(USB_HOST2_DM)* V2(USB_HOST2_DP)* V37(USB3_HOST1_SSRXN/SATA1_RXN)* V38(USB3_HOST1_SSRXP/SATA1_RXP)* W37(USB3_HOST1_SSTXP/SATA1_TXP)* W38(USB3_HOST1_SSTXN/SATA1_TXN)* Y1(USB_HOST3_DM)* Y2(USB_HOST3_DP)*

### Library data of the parts
R2 R3 = RES 2.2K: RES 2.2k 1% 62.5mW 0402; Size: 0402; Manufacturer Part Number 1: RC0402FR-075K6L
U1 = RK3566: as U1 on sheet RK3566_Power; SnapEDA_Link: https://www.snapeda.com/parts/RK3566/Fuzhou+Rockchip+Electronics+Co/view-part/?ref=snap; Package: None; Value: *; MP: RK3566; Check_prices: https://www.snapeda.com/parts/RK3566/Fuzhou+Rockchip+Electronics+Co/view-part/?ref=eda

## Sheet Connectors.SchDoc
size A3; SheetNumber: 5; SheetTotal: 6
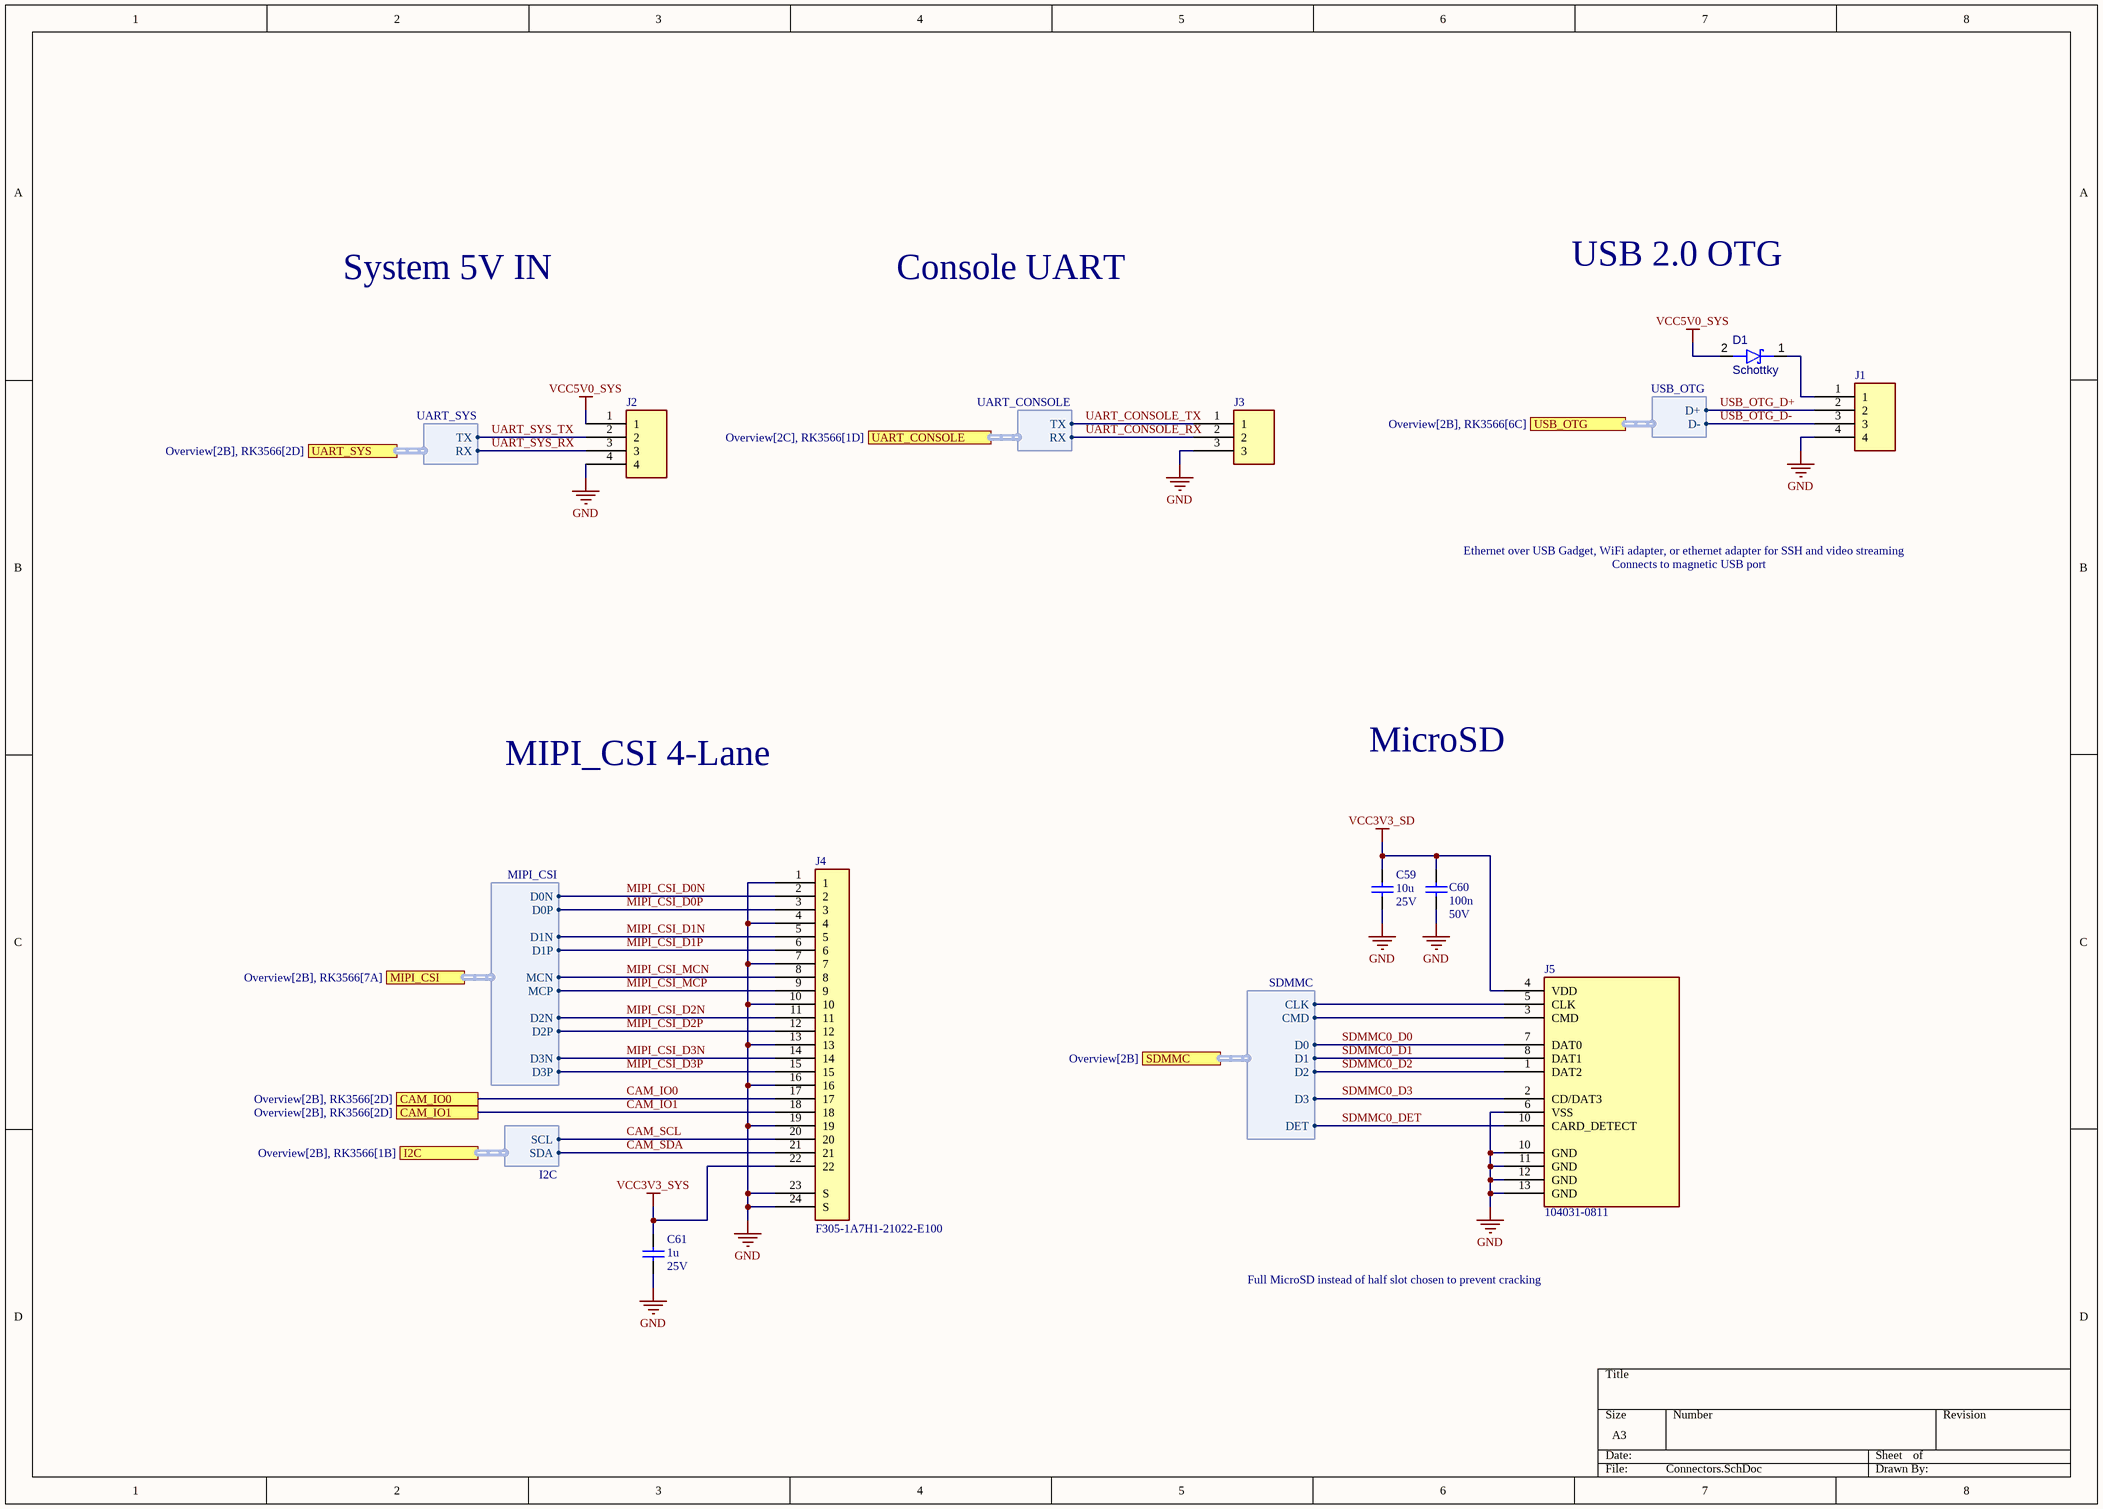
[diagram p6: Connectors.SchDoc]

### Parts
C59  value 10u  Voltage: 25V  (hidden comment: GRM188R61E106MA73D)
C60  value 100n  Voltage: 50V  [GRM155R71H104KE14D]  (hidden comment: GRM155R71H104KE14D)
C61  value 1u  Voltage: 25V  [GRM155R61E105KA12D]  (hidden comment: GRM155R61E105KA12D)
D1  Schottky  [MicroSMP (DO-219AD)]
J1  SM04B-SRSS-TB  [SM04B-SRSS-TB]  (value not drawn)
J2  SM04B-SRSS-TB  [SM04B-SRSS-TB]  (value not drawn)
J3  SM03B-SRSS-TB  [SM03B-SRSS-TB]  (value not drawn)
J4  F305-1A7H1-21022-E100  [F305-1A7H1-21022-E100]
J5  104031-0811  [104031-0811]

### Ports
CAM_IO0 (see Overview[2B], RK3566[2D]), CAM_IO1 (see Overview[2B], RK3566[2D]), I2C (harness I2C, see Overview[2B], RK3566[1B]), MIPI_CSI (harness MIPI_CSI, see Overview[2B], RK3566[7A]), SDMMC (harness SDMMC, see Overview[2B]), UART_CONSOLE (harness UART_CONSOLE, see Overview[2C], RK3566[1D]), UART_SYS (harness UART_SYS, see Overview[2B], RK3566[2D]), USB_OTG (harness USB_OTG, see Overview[2B], RK3566[6C])

### Harnesses
USB_OTG: D+, D-
MIPI_CSI: D0N, D0P, MCN, MCP, D1P, D1N, D2N, D2P, D3N, D3P
SDMMC: CLK, CMD, D0, D1, D3, D2, DET
UART_SYS: TX, RX
UART_CONSOLE: TX, RX
I2C: SCL, SDA

### Nets
GND: C59.2 C60.2 C61.2 J1.4 J2.4 J3.3 J4.1 J4.4 J4.7 J4.10 J4.13 J4.16 J4.19 J4.23(S) J4.24(S) J5.6(VSS) J5.10(GND) J5.11(GND) J5.12(GND) J5.13(GND)
VCC3V3_SD: C59.1 C60.1 J5.4(VDD)
VCC3V3_SYS: C61.1 J4.22
VCC5V0_SYS: D1.2(A) J2.1
CAM_IO0: J4.17 ; port CAM_IO0
CAM_IO1: J4.18 ; port CAM_IO1
CAM_SCL: J4.20 ; port I2C.SCL
CAM_SDA: J4.21 ; port I2C.SDA
MIPI_CSI_D0N: J4.2 ; port MIPI_CSI.D0N
MIPI_CSI_D0P: J4.3 ; port MIPI_CSI.D0P
MIPI_CSI_D1N: J4.5 ; port MIPI_CSI.D1N
MIPI_CSI_D1P: J4.6 ; port MIPI_CSI.D1P
MIPI_CSI_D2N: J4.11 ; port MIPI_CSI.D2N
MIPI_CSI_D2P: J4.12 ; port MIPI_CSI.D2P
MIPI_CSI_D3N: J4.14 ; port MIPI_CSI.D3N
MIPI_CSI_D3P: J4.15 ; port MIPI_CSI.D3P
MIPI_CSI_MCN: J4.8 ; port MIPI_CSI.MCN
MIPI_CSI_MCP: J4.9 ; port MIPI_CSI.MCP
SDMMC0_CLK: J5.5(CLK) ; port SDMMC.CLK
SDMMC0_CMD: J5.3(CMD) ; port SDMMC.CMD
SDMMC0_D0: J5.7(DAT0) ; port SDMMC.D0
SDMMC0_D1: J5.8(DAT1) ; port SDMMC.D1
SDMMC0_D2: J5.1(DAT2) ; port SDMMC.D2
SDMMC0_D3: J5.2(CD/DAT3) ; port SDMMC.D3
SDMMC0_DET: J5.10(CARD_DETECT) ; port SDMMC.DET
UART_CONSOLE_RX: J3.2 ; port UART_CONSOLE.RX
UART_CONSOLE_TX: J3.1 ; port UART_CONSOLE.TX
UART_SYS_RX: J2.3 ; port UART_SYS.RX
UART_SYS_TX: J2.2 ; port UART_SYS.TX
USB_OTG_D+: J1.2 ; port USB_OTG.D+
USB_OTG_D-: J1.3 ; port USB_OTG.D-
NetD1_1: D1.1(K) J1.1

### Notes on the sheet
- System 5V IN
- Console UART
- USB 2.0 OTG
- Ethernet over USB Gadget, WiFi adapter, or ethernet adapter for SSH and video streaming
- Connects to magnetic USB port
- MIPI_CSI 4-Lane
- MicroSD
- Full MicroSD instead of half slot chosen to prevent cracking

### Library data of the parts
C59 = GRM188R61E106MA73D: CAP 10U 25V X5R 0603; Size: 0603; Dielectric: X5R
C60 = GRM155R71H104KE14D: CAP 100N 50V X7R 0402; Size: 0402; Dielectric: X7R; Manufacturer Part Number 1: GRM155R71H104KE14D
C61 = GRM155R61E105KA12D: CAP 1U 25V X5R 0402; Size: 0402; Dielectric: X5R; Manufacturer Part Number 1: GRM155R61E105KA12D
D1 = Schottky: Diode
J1 J2 = SM04B-SRSS-TB: JST-SH 4P; Manufacturer Part Number 1: SM04B-SRSS-TB
J3 = SM03B-SRSS-TB: JST-SH 3P; Manufacturer Part Number 1: SM03B-SRSS-TB
J4 = F305-1A7H1-21022-E100: FPC
J5 = 104031-0811: Micro SD

## Sheet DDR4.SchDoc
size A3; SheetNumber: 4; SheetTotal: 6
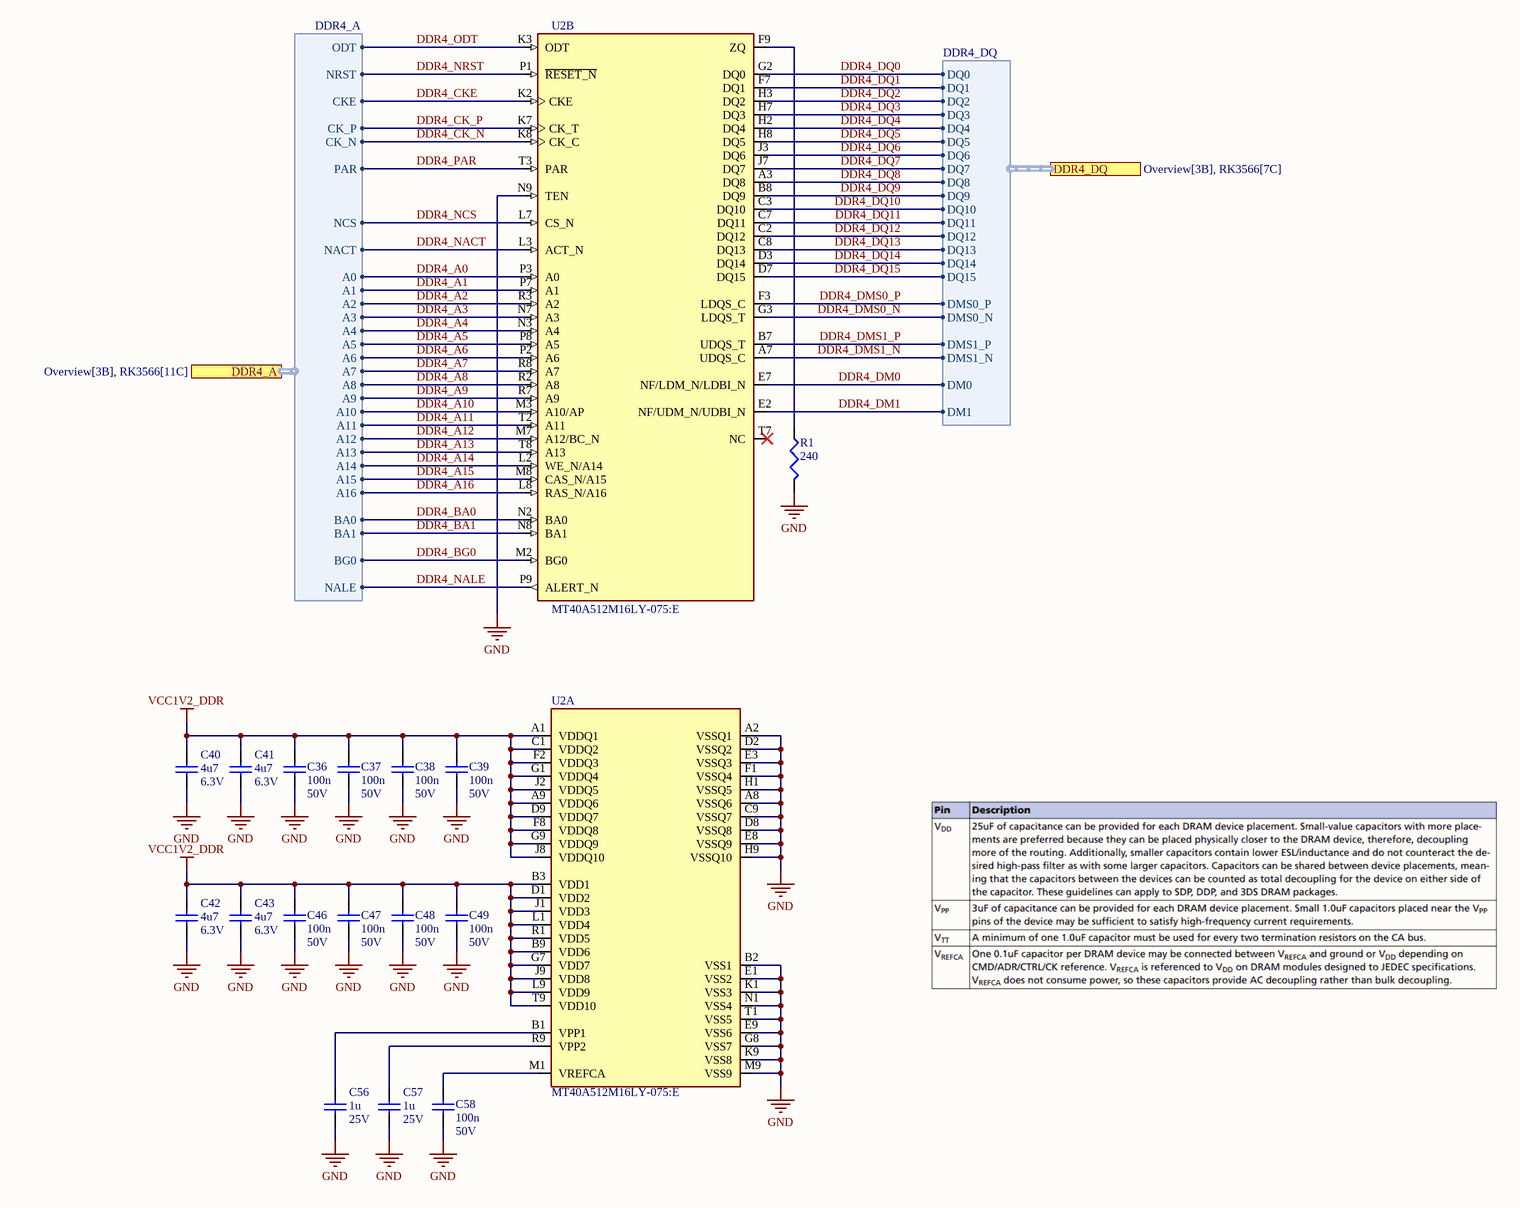
[diagram p7: DDR4.SchDoc]

### Parts
C36  value 100n  Voltage: 50V  [GRM155R71H104KE14D]  (hidden comment: GRM155R71H104KE14D)
C37  value 100n  Voltage: 50V  [GRM155R71H104KE14D]  (hidden comment: GRM155R71H104KE14D)
C38  value 100n  Voltage: 50V  [GRM155R71H104KE14D]  (hidden comment: GRM155R71H104KE14D)
C39  value 100n  Voltage: 50V  [GRM155R71H104KE14D]  (hidden comment: GRM155R71H104KE14D)
C40  value 4u7  Voltage: 6.3V  [GRM155R60J475ME47D]  (hidden comment: GRM155R60J475ME47D)
C41  value 4u7  Voltage: 6.3V  [GRM155R60J475ME47D]  (hidden comment: GRM155R60J475ME47D)
C42  value 4u7  Voltage: 6.3V  [GRM155R60J475ME47D]  (hidden comment: GRM155R60J475ME47D)
C43  value 4u7  Voltage: 6.3V  [GRM155R60J475ME47D]  (hidden comment: GRM155R60J475ME47D)
C46  value 100n  Voltage: 50V  [GRM155R71H104KE14D]  (hidden comment: GRM155R71H104KE14D)
C47  value 100n  Voltage: 50V  [GRM155R71H104KE14D]  (hidden comment: GRM155R71H104KE14D)
C48  value 100n  Voltage: 50V  [GRM155R71H104KE14D]  (hidden comment: GRM155R71H104KE14D)
C49  value 100n  Voltage: 50V  [GRM155R71H104KE14D]  (hidden comment: GRM155R71H104KE14D)
C56  value 1u  Voltage: 25V  [GRM155R61E105KA12D]  (hidden comment: GRM155R61E105KA12D)
C57  value 1u  Voltage: 25V  [GRM155R61E105KA12D]  (hidden comment: GRM155R61E105KA12D)
C58  value 100n  Voltage: 50V  [GRM155R71H104KE14D]  (hidden comment: GRM155R71H104KE14D)
R1  value 240  [RC0402FR-0718KL]  (hidden comment: RES 240)
U2  MT40A512M16LY-075:E  [MT40A512M16LY-075:E]  (parts A,B of 2)

### Ports
DDR4_A (harness DDR4_A, see Overview[3B], RK3566[11C]), DDR4_DQ (harness DDR4_DQ, see Overview[3B], RK3566[7C])

### Harnesses
DDR4_A: A0, A1, A2, A3, A4, A5, A6, A7, A8, A10, A9, A11, A13, A12, A14, A15, A16, BA0, ODT, NCS, PAR, NALE, NRST, CKE, CK_P, CK_N, NACT, BA1, BG0
DDR4_DQ: DQ0, DQ1, DQ2, DQ3, DQ4, DQ5, DQ6, DQ7, DQ8, DQ10, DQ9, DQ11, DQ13, DQ12, DQ14, DQ15, DMS0_P, DMS0_N, DMS1_N, DMS1_P, DM0, DM1

### Nets
GND: C36.2 C37.2 C38.2 C39.2 C40.2 C41.2 C42.2 C43.2 C46.2 C47.2 C48.2 C49.2 C56.2 C57.2 C58.2 R1.1 U2.A2(VSSQ1) U2.A8(VSSQ6) U2.B2(VSS1) U2.C9(VSSQ7) U2.D2(VSSQ2) U2.D8(VSSQ8) U2.E1(VSS2) U2.E3(VSSQ3) U2.E8(VSSQ9) U2.E9(VSS6) U2.F1(VSSQ4) U2.G8(VSS7) U2.H1(VSSQ5) U2.H9(VSSQ10) U2.K1(VSS3) U2.K9(VSS8) U2.M9(VSS9) U2.N1(VSS4) U2.N9(TEN) U2.T1(VSS5)
VCC1V2_DDR: C36.1 C37.1 C38.1 C39.1 C40.1 C41.1 C42.1 C43.1 C46.1 C47.1 C48.1 C49.1 U2.A1(VDDQ1) U2.A9(VDDQ6) U2.B3(VDD1) U2.B9(VDD6) U2.C1(VDDQ2) U2.D1(VDD2) U2.D9(VDDQ7) U2.F2(VDDQ3) U2.F8(VDDQ8) U2.G1(VDDQ4) U2.G7(VDD7) U2.G9(VDDQ9) U2.J1(VDD3) U2.J2(VDDQ5) U2.J8(VDDQ10) U2.J9(VDD8) U2.L1(VDD4) U2.L9(VDD9) U2.R1(VDD5) U2.T9(VDD10)
DDR4_A0: U2.P3(A0) ; port DDR4_A.A0
DDR4_A1: U2.P7(A1) ; port DDR4_A.A1
DDR4_A2: U2.R3(A2) ; port DDR4_A.A2
DDR4_A3: U2.N7(A3) ; port DDR4_A.A3
DDR4_A4: U2.N3(A4) ; port DDR4_A.A4
DDR4_A5: U2.P8(A5) ; port DDR4_A.A5
DDR4_A6: U2.P2(A6) ; port DDR4_A.A6
DDR4_A7: U2.R8(A7) ; port DDR4_A.A7
DDR4_A8: U2.R2(A8) ; port DDR4_A.A8
DDR4_A9: U2.R7(A9) ; port DDR4_A.A9
DDR4_A10: U2.M3(A10/AP) ; port DDR4_A.A10
DDR4_A11: U2.T2(A11) ; port DDR4_A.A11
DDR4_A12: U2.M7(A12/BC_N) ; port DDR4_A.A12
DDR4_A13: U2.T8(A13) ; port DDR4_A.A13
DDR4_A14: U2.L2(WE_N/A14) ; port DDR4_A.A14
DDR4_A15: U2.M8(CAS_N/A15) ; port DDR4_A.A15
DDR4_A16: U2.L8(RAS_N/A16) ; port DDR4_A.A16
DDR4_BA0: U2.N2(BA0) ; port DDR4_A.BA0
DDR4_BA1: U2.N8(BA1) ; port DDR4_A.BA1
DDR4_BG0: U2.M2(BG0) ; port DDR4_A.BG0
DDR4_CK_N: U2.K8(CK_C) ; port DDR4_A.CK_N
DDR4_CK_P: U2.K7(CK_T) ; port DDR4_A.CK_P
DDR4_CKE: U2.K2(CKE) ; port DDR4_A.CKE
DDR4_DM0: U2.E7(NF/LDM_N/LDBI_N) ; port DDR4_DQ.DM0
DDR4_DM1: U2.E2(NF/UDM_N/UDBI_N) U2.F7(DQ1) ; port DDR4_DQ.DQ1, port DDR4_DQ.DM1  [also labelled DDR4_DQ1]
DDR4_DMS0_N: U2.G3(LDQS_T) ; port DDR4_DQ.DMS0_N
DDR4_DMS0_P: U2.F3(LDQS_C) ; port DDR4_DQ.DMS0_P
DDR4_DMS1_N: U2.A7(UDQS_C) ; port DDR4_DQ.DMS1_N
DDR4_DMS1_P: U2.B7(UDQS_T) ; port DDR4_DQ.DMS1_P
DDR4_DQ0: U2.G2(DQ0) ; port DDR4_DQ.DQ0
DDR4_DQ2: U2.H3(DQ2) ; port DDR4_DQ.DQ2
DDR4_DQ3: U2.H7(DQ3) ; port DDR4_DQ.DQ3
DDR4_DQ4: U2.H2(DQ4) ; port DDR4_DQ.DQ4
DDR4_DQ5: U2.H8(DQ5) ; port DDR4_DQ.DQ5
DDR4_DQ6: U2.J3(DQ6) ; port DDR4_DQ.DQ6
DDR4_DQ7: U2.J7(DQ7) ; port DDR4_DQ.DQ7
DDR4_DQ8: U2.A3(DQ8) ; port DDR4_DQ.DQ8
DDR4_DQ9: U2.B8(DQ9) ; port DDR4_DQ.DQ9
DDR4_DQ10: U2.C3(DQ10) ; port DDR4_DQ.DQ10
DDR4_DQ11: U2.C7(DQ11) ; port DDR4_DQ.DQ11
DDR4_DQ12: U2.C2(DQ12) ; port DDR4_DQ.DQ12
DDR4_DQ13: U2.C8(DQ13) ; port DDR4_DQ.DQ13
DDR4_DQ14: U2.D3(DQ14) ; port DDR4_DQ.DQ14
DDR4_DQ15: U2.D7(DQ15) ; port DDR4_DQ.DQ15
DDR4_NACT: U2.L3(ACT_N) ; port DDR4_A.NACT
DDR4_NALE: U2.P9(ALERT_N) ; port DDR4_A.NALE
DDR4_NCS: U2.L7(CS_N) ; port DDR4_A.NCS
DDR4_NRST: U2.P1(~{RESET_N}) ; port DDR4_A.NRST
DDR4_ODT: U2.K3(ODT) ; port DDR4_A.ODT
DDR4_PAR: U2.T3(PAR) ; port DDR4_A.PAR
NetC56_1: C56.1 U2.B1(VPP1)
NetC57_1: C57.1 U2.R9(VPP2)
NetC58_1: C58.1 U2.M1(VREFCA)
NetR1_2: R1.2 U2.F9(ZQ)

Not connected (* = marked no-connect by the designer): U2 T7(NC)*

### Library data of the parts
C36-C39 C46-C49 C58 = GRM155R71H104KE14D: CAP 100N 50V X7R 0402; Size: 0402; Dielectric: X7R; Manufacturer Part Number 1: GRM155R71H104KE14D
C40-C43 = GRM155R60J475ME47D: CAP 4.7U 6.3V X5R 0402; Size: 0402; Dielectric: X5R; Manufacturer Part Number 1: GRM155R60J475ME47D
C56 C57 = GRM155R61E105KA12D: CAP 1U 25V X5R 0402; Size: 0402; Dielectric: X5R; Manufacturer Part Number 1: GRM155R61E105KA12D
R1 = RES 240: RES 240 1% 62.5mW 0402; Size: 0402; Manufacturer Part Number 1: RC0402FR-0718KL
U2 = MT40A512M16LY-075:E: SDRAM - DDR4 Memory IC 8Gb (512M x 16) Parallel 1.33 GHz 96-FBGA (7.5x13.5); MF: Micron Technology Inc.; SnapEDA_Link: https://www.snapeda.com/parts/MT40A512M16LY-075:E/Micron/view-part/?ref=snap; Package: TFBGA-96 Micron Technology; Value: *; MP: MT40A512M16LY-075:E; Check_prices: https://www.snapeda.com/parts/MT40A512M16LY-075:E/Micron/view-part/?ref=eda

## Sheet Power.SchDoc
size A3; SheetNumber: 6; SheetTotal: 6
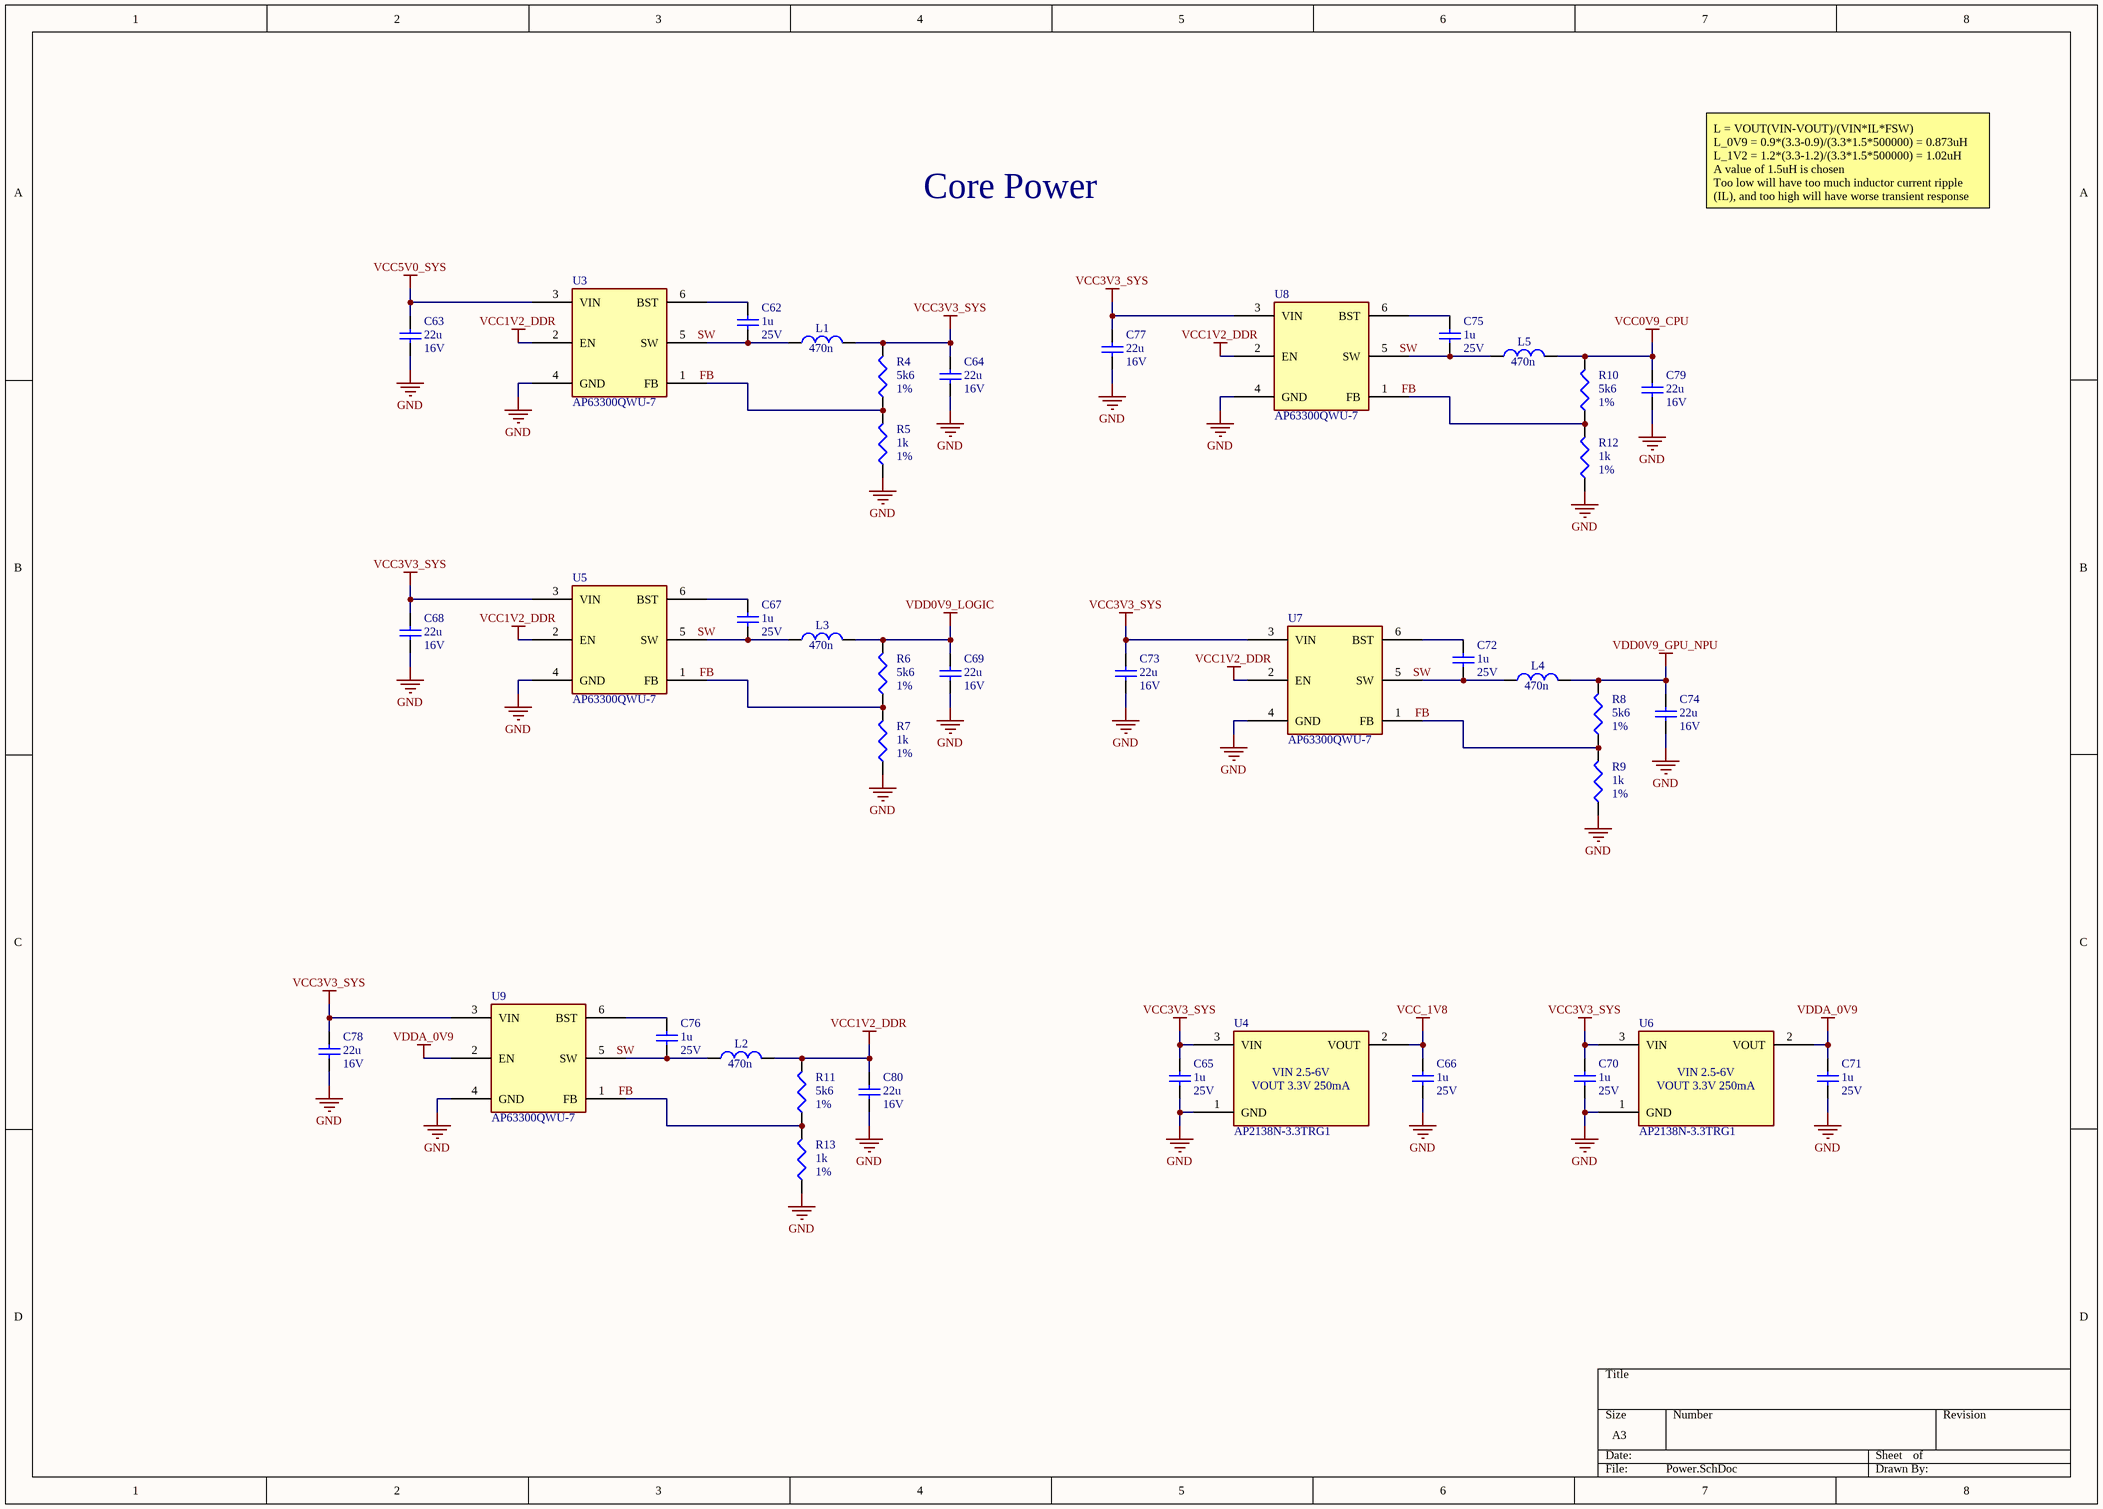
[diagram p8: Power.SchDoc]

### Parts
C62  value 1u  Voltage: 25V  [GRM155R61E105KA12D]  (hidden comment: GRM155R61E105KA12D)
C63  value 22u  Voltage: 16V  [GRM188R61C226ME01D]  (hidden comment: GRM188R61C226ME01D)
C64  value 22u  Voltage: 16V  [GRM188R61C226ME01D]  (hidden comment: GRM188R61C226ME01D)
C65  value 1u  Voltage: 25V  [GRM155R61E105KA12D]  (hidden comment: GRM155R61E105KA12D)
C66  value 1u  Voltage: 25V  [GRM155R61E105KA12D]  (hidden comment: GRM155R61E105KA12D)
C67  value 1u  Voltage: 25V  [GRM155R61E105KA12D]  (hidden comment: GRM155R61E105KA12D)
C68  value 22u  Voltage: 16V  [GRM188R61C226ME01D]  (hidden comment: GRM188R61C226ME01D)
C69  value 22u  Voltage: 16V  [GRM188R61C226ME01D]  (hidden comment: GRM188R61C226ME01D)
C70  value 1u  Voltage: 25V  [GRM155R61E105KA12D]  (hidden comment: GRM155R61E105KA12D)
C71  value 1u  Voltage: 25V  [GRM155R61E105KA12D]  (hidden comment: GRM155R61E105KA12D)
C72  value 1u  Voltage: 25V  [GRM155R61E105KA12D]  (hidden comment: GRM155R61E105KA12D)
C73  value 22u  Voltage: 16V  [GRM188R61C226ME01D]  (hidden comment: GRM188R61C226ME01D)
C74  value 22u  Voltage: 16V  [GRM188R61C226ME01D]  (hidden comment: GRM188R61C226ME01D)
C75  value 1u  Voltage: 25V  [GRM155R61E105KA12D]  (hidden comment: GRM155R61E105KA12D)
C76  value 1u  Voltage: 25V  [GRM155R61E105KA12D]  (hidden comment: GRM155R61E105KA12D)
C77  value 22u  Voltage: 16V  [GRM188R61C226ME01D]  (hidden comment: GRM188R61C226ME01D)
C78  value 22u  Voltage: 16V  [GRM188R61C226ME01D]  (hidden comment: GRM188R61C226ME01D)
C79  value 22u  Voltage: 16V  [GRM188R61C226ME01D]  (hidden comment: GRM188R61C226ME01D)
C80  value 22u  Voltage: 16V  [GRM188R61C226ME01D]  (hidden comment: GRM188R61C226ME01D)
L1  value 470n  [DFE322520FD-1R5M]  (hidden comment: DFE322520FD-1R5M)
L2  value 470n  [DFE322520FD-1R5M]  (hidden comment: DFE322520FD-1R5M)
L3  value 470n  [DFE322520FD-1R5M]  (hidden comment: DFE322520FD-1R5M)
L4  value 470n  [DFE322520FD-1R5M]  (hidden comment: DFE322520FD-1R5M)
L5  value 470n  [DFE322520FD-1R5M]  (hidden comment: DFE322520FD-1R5M)
R4  value 5k6  Tolerance: 1%  [RC0402FR-075K6L]  (hidden comment: RC0402FR-075K6L)
R5  value 1k  Tolerance: 1%  [RC0402FR-071KL]  (hidden comment: RC0402FR-071KL)
R6  value 5k6  Tolerance: 1%  [RC0402FR-075K6L]  (hidden comment: RC0402FR-075K6L)
R7  value 1k  Tolerance: 1%  [RC0402FR-071KL]  (hidden comment: RC0402FR-071KL)
R8  value 5k6  Tolerance: 1%  [RC0402FR-075K6L]  (hidden comment: RC0402FR-075K6L)
R9  value 1k  Tolerance: 1%  [RC0402FR-071KL]  (hidden comment: RC0402FR-071KL)
R10  value 5k6  Tolerance: 1%  [RC0402FR-075K6L]  (hidden comment: RC0402FR-075K6L)
R11  value 5k6  Tolerance: 1%  [RC0402FR-075K6L]  (hidden comment: RC0402FR-075K6L)
R12  value 1k  Tolerance: 1%  [RC0402FR-071KL]  (hidden comment: RC0402FR-071KL)
R13  value 1k  Tolerance: 1%  [RC0402FR-071KL]  (hidden comment: RC0402FR-071KL)
U3  AP63300QWU-7  [AP63300QWU-7]
U4  AP2138N-3.3TRG1  [AP2138N-3.3TRG1]
U5  AP63300QWU-7  [AP63300QWU-7]
U6  AP2138N-3.3TRG1  [AP2138N-3.3TRG1]
U7  AP63300QWU-7  [AP63300QWU-7]
U8  AP63300QWU-7  [AP63300QWU-7]
U9  AP63300QWU-7  [AP63300QWU-7]

### Nets
GND: C63.2 C64.2 C65.2 C66.2 C68.2 C69.2 C70.2 C71.2 C73.2 C74.2 C77.2 C78.2 C79.2 C80.2 R5.2 R7.2 R9.2 R12.2 R13.2 U3.4(GND) U4.1(GND) U5.4(GND) U6.1(GND) U7.4(GND) U8.4(GND) U9.4(GND)
VCC0V9_CPU: C79.1 L5.2 R10.1
VCC1V2_DDR: C80.1 L2.2 R11.1 U3.2(EN) U5.2(EN) U7.2(EN) U8.2(EN)
VCC3V3_SYS: C64.1 C65.1 C68.1 C70.1 C73.1 C77.1 C78.1 L1.2 R4.1 U4.3(VIN) U5.3(VIN) U6.3(VIN) U7.3(VIN) U8.3(VIN) U9.3(VIN)
VCC5V0_SYS: C63.1 U3.3(VIN)
VCC_1V8: C66.1 U4.2(VOUT)
VDD0V9_GPU_NPU: C74.1 L4.2 R8.1
VDD0V9_LOGIC: C69.1 L3.2 R6.1
VDDA_0V9: C71.1 U6.2(VOUT) U9.2(EN)
FB: R4.2 R5.1 R6.2 R7.1 R8.2 R9.1 R10.2 R11.2 R12.1 R13.1 U3.1(FB) U5.1(FB) U7.1(FB) U8.1(FB) U9.1(FB)
SW: C62.2 C67.2 C72.2 C75.2 C76.2 L1.1 L2.1 L3.1 L4.1 L5.1 U3.5(SW) U5.5(SW) U7.5(SW) U8.5(SW) U9.5(SW)
NetC62_1: C62.1 U3.6(BST)
NetC67_1: C67.1 U5.6(BST)
NetC72_1: C72.1 U7.6(BST)
NetC75_1: C75.1 U8.6(BST)
NetC76_1: C76.1 U9.6(BST)

### Notes on the sheet
- Core Power
- L = VOUT(VIN-VOUT)/(VIN*IL*FSW)
  L_0V9 = 0.9*(3.3-0.9)/(3.3*1.5*500000) = 0.873uH
  L_1V2 = 1.2*(3.3-1.2)/(3.3*1.5*500000) = 1.02uH
  A value of 1.5uH is chosen
  Too low will have too much inductor current ripple (IL), and too high will have worse transient response
- (in symbol AP2138N-3.3TRG1) VIN 2.5-6V; VOUT 3.3V 250mA

### Library data of the parts
C62 C65-C67 C70-C72 C75 C76 = GRM155R61E105KA12D: CAP 1U 25V X5R 0402; Size: 0402; Dielectric: X5R; Manufacturer Part Number 1: GRM155R61E105KA12D
C63 C64 C68 C69 C73 C74 C77-C80 = GRM188R61C226ME01D: CAP 22U 16V X5R 0603; Size: 0603; Dielectric: X5R; Manufacturer Part Number 1: GRM188R61C226ME01D
L1-L5 = DFE322520FD-1R5M: IND 1.5U 6A 1210
R4 R6 R8 R10 R11 = RC0402FR-075K6L: RES 5.6k 1% 62.5mW 0402; Size: 0603; Manufacturer Part Number 1: RC0402FR-075K6L
R5 R7 R9 R12 R13 = RC0402FR-071KL: RES 1k 1% 62.5mW 0402; Size: 0603; Manufacturer Part Number 1: RC0402FR-071KL
U3 U5 U7-U9 = AP63300QWU-7: BUCK 3A; Manufacturer Part Number 1: AP63300QWU-7
U4 U6 = AP2138N-3.3TRG1: LDO 3.3V 250mA; Manufacturer Part Number 1: AP2138N-3.3TRG1

## Nets that join several sheets
GND: RK3566_Power (213 pins), Connectors (20 pins), DDR4 (36 pins), Power (26 pins)
VCC1V2_DDR: DDR4 (32 pins), Power (7 pins)
VCC3V3_SYS: RK3566_Power (11 pins), RK3566 (R2.1 R3.1), Connectors (C61.1 J4.22), Power (15 pins)
VCC5V0_SYS: Connectors (D1.2 J2.1), Power (C63.1 U3.3)
VCC_1V8: RK3566_Power (12 pins), Power (C66.1 U4.2)
VDD0V9_GPU_NPU: RK3566_Power (15 pins), Power (C74.1 L4.2 R8.1)
VDDA_0V9: RK3566_Power (12 pins), Power (C71.1 U6.2 U9.2)
CAM_IO0: RK3566 (U1.1E18), Connectors (J4.17)
CAM_IO1: RK3566 (U1.1D18), Connectors (J4.18)
CAM_SCL: RK3566 (R2.2 U1.AR12), Connectors (J4.20)
CAM_SDA: RK3566 (R3.2 U1.AP11), Connectors (J4.21)
DDR4_A0: RK3566 (U1.A7), DDR4 (U2.P3)
DDR4_A1: RK3566 (U1.1D2), DDR4 (U2.P7)
DDR4_A2: RK3566 (U1.C1), DDR4 (U2.R3)
DDR4_A3: RK3566 (U1.1C3), DDR4 (U2.N7)
DDR4_A4: RK3566 (U1.1B6), DDR4 (U2.N3)
DDR4_A5: RK3566 (U1.B8), DDR4 (U2.P8)
DDR4_A6: RK3566 (U1.B9), DDR4 (U2.P2)
DDR4_A7: RK3566 (U1.A10), DDR4 (U2.R8)
DDR4_A8: RK3566 (U1.E2), DDR4 (U2.R2)
DDR4_A9: RK3566 (U1.B7), DDR4 (U2.R7)
DDR4_A10: RK3566 (U1.1A3), DDR4 (U2.M3)
DDR4_A11: RK3566 (U1.C2), DDR4 (U2.T2)
DDR4_A12: RK3566 (U1.1B3), DDR4 (U2.M7)
DDR4_A13: RK3566 (U1.A9), DDR4 (U2.T8)
DDR4_A14: RK3566 (U1.1B1), DDR4 (U2.L2)
DDR4_A15: RK3566 (U1.1C1), DDR4 (U2.M8)
DDR4_A16: RK3566 (U1.1A1), DDR4 (U2.L8)
DDR4_BA0: RK3566 (U1.1B7), DDR4 (U2.N2)
DDR4_BA1: RK3566 (U1.1A6), DDR4 (U2.N8)
DDR4_BG0: RK3566 (U1.1A4), DDR4 (U2.M2)
DDR4_CK_N: RK3566 (U1.B5), DDR4 (U2.K8)
DDR4_CK_P: RK3566 (U1.A5), DDR4 (U2.K7)
DDR4_CKE: RK3566 (U1.B4), DDR4 (U2.K2)
DDR4_DM0: RK3566 (U1.1E2), DDR4 (U2.E7)
DDR4_DM1: RK3566 (U1.1G1 U1.F2), DDR4 (U2.E2 U2.F7)
DDR4_DMS0_N: RK3566 (U1.A12), DDR4 (U2.G3)
DDR4_DMS0_P: RK3566 (U1.A13), DDR4 (U2.F3)
DDR4_DMS1_N: RK3566 (U1.H1), DDR4 (U2.A7)
DDR4_DMS1_P: RK3566 (U1.H2), DDR4 (U2.B7)
DDR4_DQ0: RK3566 (U1.G2), DDR4 (U2.G2)
DDR4_DQ2: RK3566 (U1.F1), DDR4 (U2.H3)
DDR4_DQ3: RK3566 (U1.E1), DDR4 (U2.H7)
DDR4_DQ4: RK3566 (U1.M2), DDR4 (U2.H2)
DDR4_DQ5: RK3566 (U1.K1), DDR4 (U2.H8)
DDR4_DQ6: RK3566 (U1.K2), DDR4 (U2.J3)
DDR4_DQ7: RK3566 (U1.1E1), DDR4 (U2.J7)
DDR4_DQ8: RK3566 (U1.P2), DDR4 (U2.A3)
DDR4_DQ9: RK3566 (U1.R1), DDR4 (U2.B8)
DDR4_DQ10: RK3566 (U1.R2), DDR4 (U2.C3)
DDR4_DQ11: RK3566 (U1.T2), DDR4 (U2.C7)
DDR4_DQ12: RK3566 (U1.M1), DDR4 (U2.C2)
DDR4_DQ13: RK3566 (U1.1F2), DDR4 (U2.C8)
DDR4_DQ14: RK3566 (U1.1F1), DDR4 (U2.D3)
DDR4_DQ15: RK3566 (U1.1G2), DDR4 (U2.D7)
DDR4_NACT: RK3566 (U1.1A2), DDR4 (U2.L3)
DDR4_NCS: RK3566 (U1.B3), DDR4 (U2.L7)
DDR4_NRST: RK3566 (U1.1C7), DDR4 (U2.P1)
DDR4_ODT: RK3566 (U1.1C2), DDR4 (U2.K3)
MIPI_CSI_D0N: RK3566 (U1.AR18), Connectors (J4.2)
MIPI_CSI_D0P: RK3566 (U1.AP18), Connectors (J4.3)
MIPI_CSI_D1N: RK3566 (U1.AP17), Connectors (J4.5)
MIPI_CSI_D1P: RK3566 (U1.AR17), Connectors (J4.6)
MIPI_CSI_D2N: RK3566 (U1.AR15), Connectors (J4.11)
MIPI_CSI_D2P: RK3566 (U1.AP15), Connectors (J4.12)
MIPI_CSI_D3N: RK3566 (U1.AP14), Connectors (J4.14)
MIPI_CSI_D3P: RK3566 (U1.AR14), Connectors (J4.15)
MIPI_CSI_MCN: RK3566 (U1.1U9), Connectors (J4.8)
MIPI_CSI_MCP: RK3566 (U1.1V9), Connectors (J4.9)
SDMMC0_CLK: RK3566 (U1.G38), Connectors (J5.5)
SDMMC0_CMD: RK3566 (U1.1E19), Connectors (J5.3)
SDMMC0_D0: RK3566 (U1.1E20), Connectors (J5.7)
SDMMC0_D1: RK3566 (U1.1F19), Connectors (J5.8)
SDMMC0_D2: RK3566 (U1.1D20), Connectors (J5.1)
SDMMC0_D3: RK3566 (U1.1F18), Connectors (J5.2)
SDMMC0_DET: RK3566 (U1.AF37), Connectors (J5.10)
UART_CONSOLE_RX: RK3566 (U1.B35), Connectors (J3.2)
UART_CONSOLE_TX: RK3566 (U1.B37), Connectors (J3.1)
UART_SYS_RX: RK3566 (U1.B34), Connectors (J2.3)
UART_SYS_TX: RK3566 (U1.1A20), Connectors (J2.2)
USB_OTG_D+: RK3566 (U1.R37), Connectors (J1.2)
USB_OTG_D-: RK3566 (U1.R38), Connectors (J1.3)